# EAGLE board J007017_RGB_IR (EAGLE 7.7.0), part 1 of 4
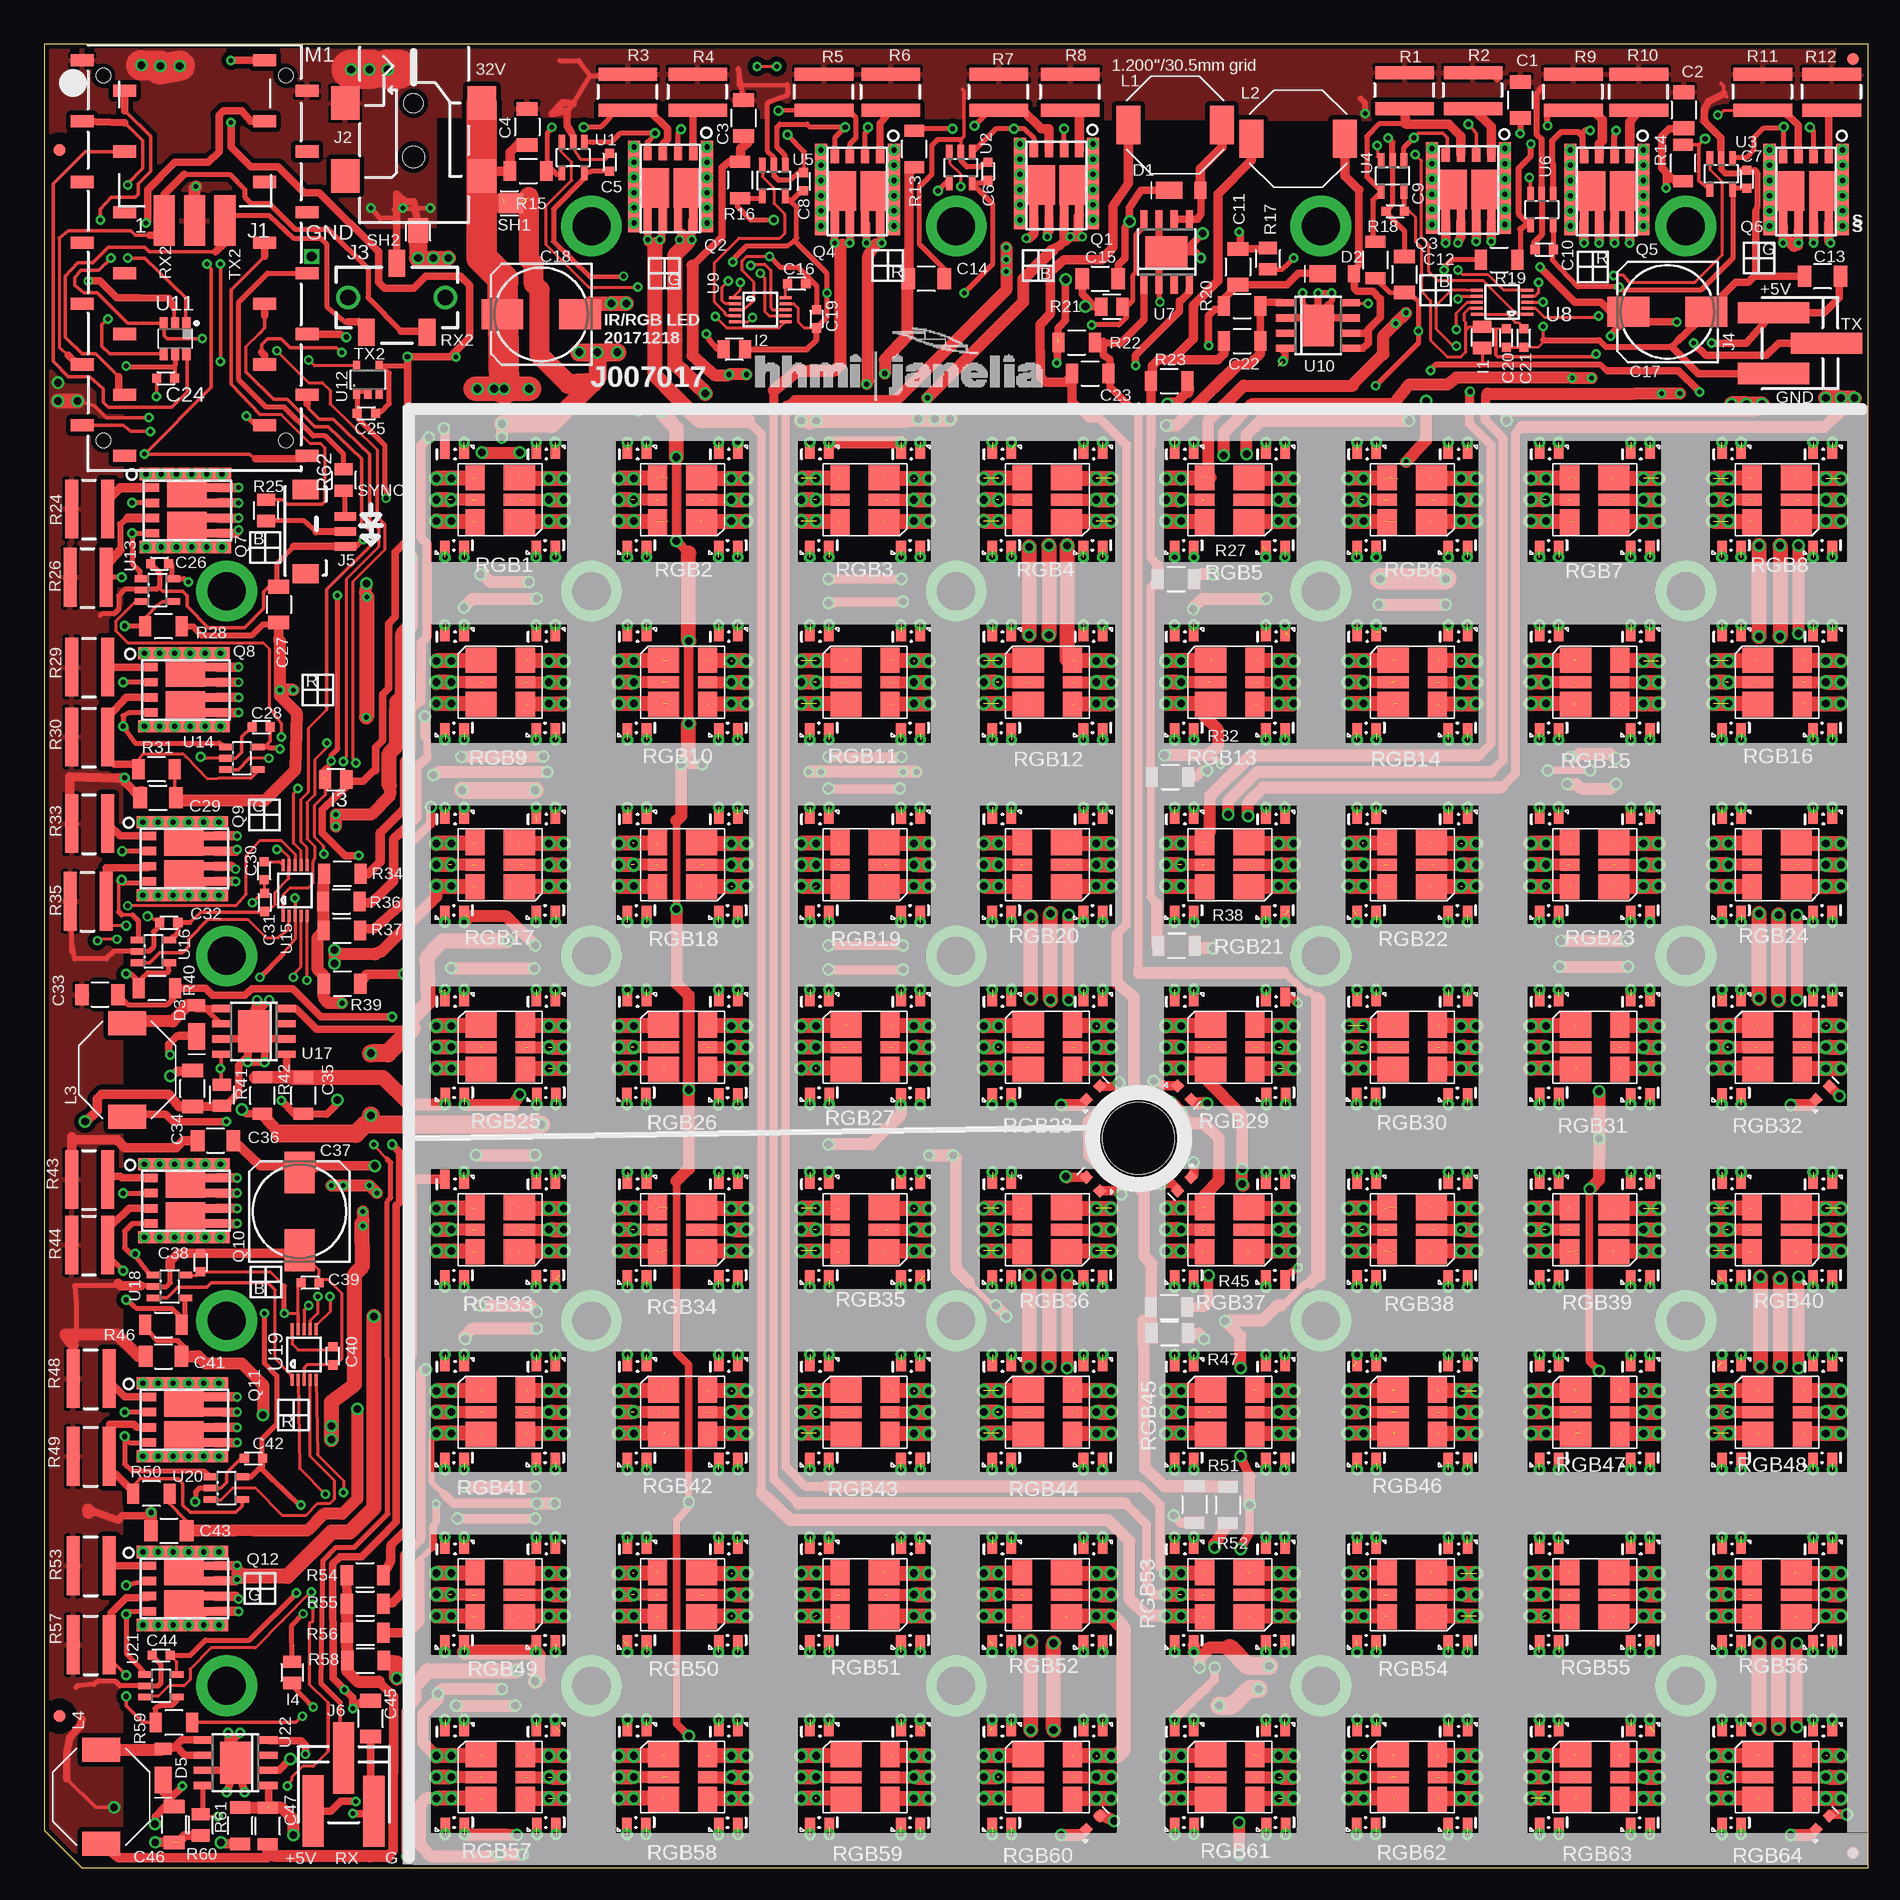
[diagram p4: board, top side]
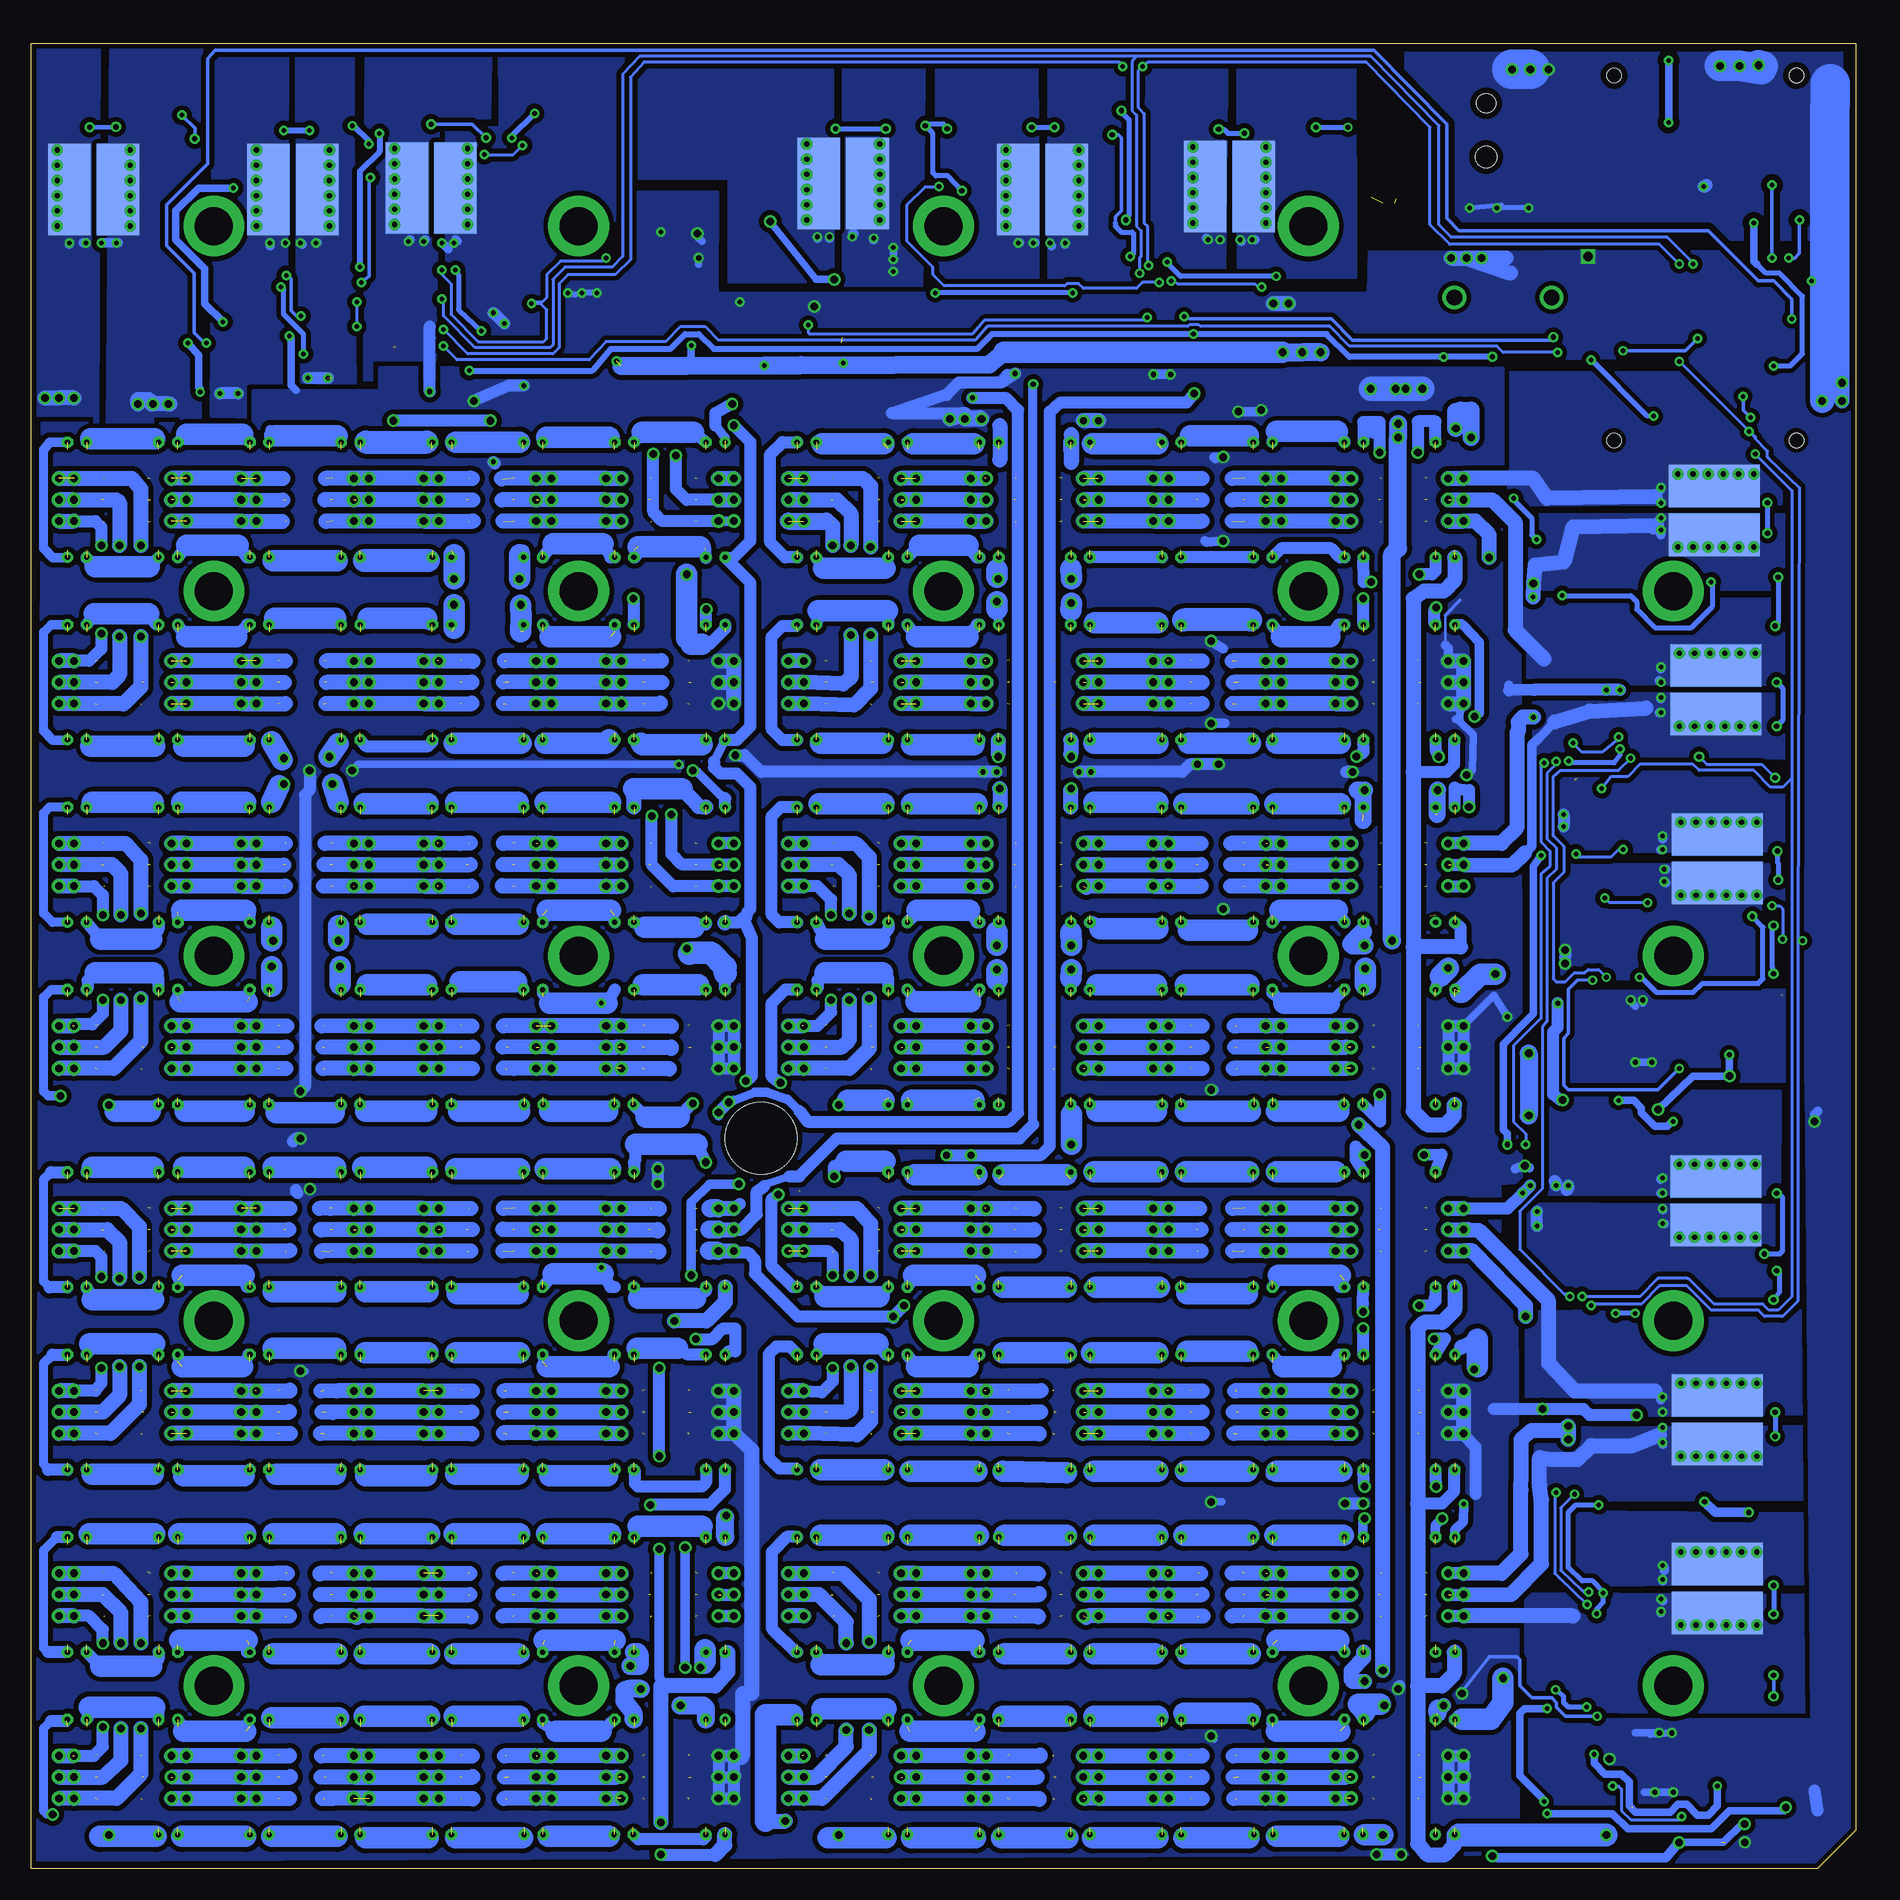
[diagram p5: board, bottom side, seen from below]

Size 152.4 x 152.4 mm. Coordinates in mm from the lower left corner, seen from the top.
Outline: 0,152.4 0,3.17 3.17,0 152.4,0 152.4,152.4 0,152.4
Copper layers (1*16): Top 0.068mm / dielectric 0.45mm / Bottom 0.068mm
Design rules "default *": minimum track width 8mil, minimum drill 12mil, track to track 8mil, track to pad 8mil, pad to pad 8mil, via to via 8mil, smd to smd 8mil, copper to edge 16mil, drill to drill 8mil, minimum pad ring 10mil, minimum via ring 8mil, stop-mask expansion 4mil, vias tented up to drill 25mil, thermal gap 10mil
Holes 5.99 mm at 91.44,60.96

## Footprints (pad centres in the part's own frame; a part is rotated, then mirrored left to right if it is on the bottom)
FIDUCIAL_1MM = smd 1 x 1: 1 0,0
1210S = smd 1.14 x 1.75: 1 -1.5,0; 2 1.5,0
0603S = smd 0.762 x 0.762: 1 -0.762,0; 2 0.762,0
153CLV-0810 = smd 3.5 x 2.5: + 3.25,0; - -3.25,0
1206S = smd 1.016 x 1.651: 1 -1.524,0; 2 1.524,0
PWRDI-123 = smd 1 x 1.4: A 1.6,0 | smd 2.2 x 1.4: K -1,0
LED_SFH4050_HEAT = smd 0.8 x 1.6: A -0.8,-0.4; C 0.8,-0.4 | drill 0.432 octagon: A1 -0.8,-1 | drill 0.432: C1 0.8,-1
0805S = smd 1.016 x 1.524: 1 -0.889,0; 2 0.889,0
LED_SFH4045_HEAT_A = smd 0.8 x 1.6: A -0.8,-0.4; C 0.8,-0.4 | drill 0.432 octagon: A1 -0.8,-1
LED_SFH4050_HEAT_C = smd 0.8 x 1.6: A -0.8,-0.4; C 0.8,-0.4 | drill 0.432: C1 0.8,-1
LED_SFH4050 = smd 0.8 x 0.8: A -0.8,0; C 0.8,0
AMP-3-SM-RA-X = smd 1.78 x 4.19: 1 -2.54,-14.78; 2 0,-14.78; 3 2.54,-14.78
PJ-002 = smd 2.8 x 2.4: 1A 5,5.7; 1B 11.1,5.7; 2 5,-5.7; 3 11.1,-5.7 | hole 1.6: 5,0 | hole 1.8: 9.5,0
AMP_3_SM = smd 1.397 x 2.261: 1 -2.54,2.883; 2 0,-2.883; 3 2.54,2.883 | drill 1.321: P$4 -4.064,0; P$5 4.064,0
TE_3_SM-V = smd 1.778 x 5.969: 1 2.54,-2.223; 2 0,2.223; 3 -2.54,-2.21
DF13_3_V_SM = smd 1.6 x 2.2: A -3.52,0.01; B 3.52,0.01 | smd 0.7 x 1.8: P$1 -1.27,3.31; P$2 -0.02,3.31; P$3 1.23,3.31
SRU8043 = smd 2.007 x 3.2: 1 -3.912,0; 2 3.912,0
TEENSY3.2_MIN_SM = smd 1.016 x 1.905: 1 -16.51,-9.398; 2 -13.97,-5.842; 3 -11.43,-9.398; 4 -8.89,-5.842; 5 -6.35,-9.398; 6 -3.81,-5.842; 7 -1.27,-9.398; 8 1.27,-5.842; 9 3.81,-9.398; 10 6.35,-5.842; 11 8.89,-9.398; 12 11.43,-5.842; 13 13.97,-9.398; 14 16.51,-5.842; 15 16.51,9.398; 16 13.97,5.842; 17 11.43,9.398; 18 8.89,5.842; 19 6.35,9.398; 20 3.81,5.842; 21 1.27,9.398; 22 -1.27,5.842; 23 -3.81,9.398; 24 -6.35,5.842; 25 -8.89,9.398; 26 -11.43,5.842; 27 -13.97,9.398; 28 -16.51,5.842 | hole 1.194: -15.24,7.62; 15.24,7.62; 15.24,-7.62; -15.24,-7.62
LFPAK56_HS2 = smd 0.7 x 1.15: 1 -1.905,-3.275; 2 -0.635,-3.275; 3 0.635,-3.275; 4 1.905,-3.275 | smd 0.7 x 1.9: 5 1.905,2.225; 6 0.635,2.225; 7 -0.635,2.225; 8 -1.905,2.225 | drill 0.432: 5A 3.048,1.27; 5A1 3.048,2.54; 5B 3.048,0; 5C 3.048,-1.27; 5C1 3.048,-2.54; 5C2 3.048,-3.81; 8A -3.048,1.27; 8B -3.048,0; 8C -3.048,-1.27; 8C1 -3.048,-2.54; 8C2 -3.048,2.54; 8C3 -3.048,-3.81 | smd 2.286 x 3.302: 56 1.27,-0.381; 78 -1.397,-0.381 | smd 1.016 x 7.62: 56A 3.048,-0.508; 78A -3.048,-0.508 | smd 3.556 x 7.62 bottom: 56B 2.032,-0.508; 78B -2.032,-0.508
1812 = smd 4.9 x 1.1: 1 0,1.5; 2 0,-1.5
OVSPRGB_HS_FIXED = smd 2.1 x 2.6: 1 1.85,1.6; 3 -1.85,1.6 | drill 0.635: 1A 1.778,4.064; 1B 1.778,5.334; 2A 0,4.064; 2B 0,5.334; 3A -1.778,4.064; 3B -1.778,5.334; 4A -1.778,-4.064; 4B -1.778,-5.334; 5A 0,-4.064; 5B 0,-5.334; 6A 1.778,-4.064; 6B 1.778,-5.334 | smd 1 x 2.6: 2 0,1.6 | smd 2.1 x 1.6: 4 -1.85,-2.1; 6 1.85,-2.1 | smd 1 x 1.6: 5 0,-2.1
JUMPER = smd 1.016 x 1.651: 1 -0.635,0; 2 0.381,0
SOT23-5 = smd 0.55 x 1.2: 1 -0.95,-1.3; 2 0,-1.3; 3 0.95,-1.3; 4 0.95,1.3; 5 -0.95,1.3
SOIC8-EP = smd 0.6 x 1.5: 1 -1.905,-2.75; 2 -0.635,-2.75; 3 0.635,-2.75; 4 1.905,-2.75; 5 1.905,2.75; 6 0.635,2.75; 7 -0.635,2.75; 8 -1.905,2.75 | smd 3.502 x 2.613: EP 0,0
MSOP10 = smd 0.25 x 1: 1 -1,-2.113; 2 -0.5,-2.113; 3 0,-2.113; 4 0.5,-2.113; 5 1,-2.113; 6 1,2.113; 7 0.5,2.113; 8 0,2.113; 9 -0.5,2.113; 10 -1,2.113
DBV_R-PDSO-G6 = smd 0.69 x 0.99: 1 -0.95,-1.29; 2 0,-1.29; 3 0.95,-1.29; 4 0.95,1.3; 5 0,1.3; 6 -0.95,1.3
SOT23-5' = smd 0.6 x 0.9: 1 -0.95,-1.15; 2 0,-1.15; 3 0.95,-1.15; 4 0.95,1.15; 5 -0.95,1.15

## Placement (x,y rotation side)
$$U$1  FIDUCIAL  [FIDUCIAL_1MM]  1.27,143.51 0 top
$$U$2  FIDUCIAL  [FIDUCIAL_1MM]  1.27,12.7 0 top
$$U$3  FIDUCIAL  [FIDUCIAL_1MM]  151.13,1.27 0 top
C1  6.8  [1210S]  123.32,147.7 90 top
C2  6.8  [1210S]  136.98,146.84 90 top
C3  6.8  [1210S]  58.42,146.18 90 top
C4  6.8  [1210S]  40.36,145.44 90 top
C5  0.1  [0603S]  47.24,142.49 90 top
C6  0.1  [0603S]  78.84,141.73 90 top
C7  0.1  [0603S]  142.24,141.07 90 top
C8  0.1  [0603S]  63.45,140.87 90 top
C9  0.1  [0603S]  112.88,138.4 180 top
C10  0.1  [0603S]  125.32,135.2 180 top
C11  10@50  [1210S]  99.75,133.76 90 top
C12  6.8  [1210S]  113.64,133.12 90 top
C13  6.8  [1210S]  148.56,132.97 0 top
C14  6.8  [1210S]  73.69,132.77 0 top
C15  10@50  [1210S]  88.24,132.77 180 top
C16  0.1  [0603S]  62.87,132.33 0 top
C17  [153CLV-0810]  135.61,130 180 top
C18  [153CLV-0810]  41.53,129.79 180 top
C19  0.1  [0603S]  64.52,129.41 90 top
C20  0.1  [0603S]  122.15,127.81 270 top
C21  0.1  [0603S]  123.62,127.81 270 top
C22  2.2@50  [1206S]  100.1,127.56 180 top
C23  2.2@50  [1206S]  87.4,124.84 180 top
C24  0.1  [0603S]  10.16,124.46 180 top
C25  0.1  [0603S]  26.92,121.54 180 top
C26  0.1  [0603S]  9.65,108.97 180 top
C27  6.8  [1210S]  19.61,105.54 90 top
C28  0.1  [0603S]  18.14,95.33 180 top
C29  6.8  [1210S]  9.53,89.41 180 top
C30  0.1  [0603S]  18.39,83.31 270 top
C31  0.1  [0603S]  18.41,80.67 90 top
C32  0.1  [0603S]  10.41,78.99 180 top
C33  6.8  [1210S]  4.67,72.97 180 top
C34  10@50  [1210S]  12.4,65.13 270 top
C35  2.2@50  [1206S]  21.67,64.54 270 top
C36  6.8  [1210S]  14.33,60.78 180 top
C37  [153CLV-0810]  21.34,54.86 90 top
C38  0.1  [0603S]  13.06,50.6 90 top
C39  0.1  [0603S]  22.23,48.9 0 top
C40  0.1  [0603S]  24.13,42.8 270 top
C41  6.8  [1210S]  9.98,42.75 180 top
C42  0.1  [0603S]  17.5,34.24 180 top
C43  6.8  [1210S]  10.41,28.19 180 top
C44  0.1  [0603S]  9.78,17.78 180 top
C45  6.8  [1210S]  27.28,12.5 270 top
C46  10@50  [1210S]  10.87,3.66 270 top
C47  2.2@50  [1206S]  18.67,3.53 270 top
D1  DLFS240L  [PWRDI-123]  95,140.16 0 top
D2  DLFS240L  [PWRDI-123]  107.82,133.17 0 top
D3  DLFS240L  [PWRDI-123]  12.75,70.48 90 top
D4  [LED_SFH4050_HEAT]  95.25,19.05 0 top
D5  DLFS240L  [PWRDI-123]  9.96,8.38 90 top
I1  [0805S]  120.14,127.86 90 top
I2  [0805S]  57.66,126.87 0 top
I3  [0805S]  24.36,90.93 180 top
I4  [0805S]  20.73,16.36 90 top
IR1  [LED_SFH4045_HEAT_A]  34.29,118.11 180 top
IR2  [LED_SFH4050_HEAT]  41.91,118.11 180 top
IR3  [LED_SFH4050_HEAT]  49.53,118.11 180 top
IR4  [LED_SFH4050_HEAT]  57.15,118.11 180 top
IR5  [LED_SFH4050_HEAT]  64.77,118.11 180 top
IR6  [LED_SFH4050_HEAT]  72.39,118.11 180 top
IR7  [LED_SFH4050_HEAT]  80.01,118.11 180 top
IR8  [LED_SFH4050_HEAT]  87.63,118.11 180 top
IR9  [LED_SFH4050_HEAT]  95.25,118.11 180 top
IR10  [LED_SFH4050_HEAT]  102.87,118.11 180 top
IR11  [LED_SFH4050_HEAT]  110.49,118.11 180 top
IR12  [LED_SFH4050_HEAT]  118.11,118.11 180 top
IR13  [LED_SFH4050_HEAT]  125.73,118.11 180 top
IR14  [LED_SFH4050_HEAT]  133.35,118.11 180 top
IR15  [LED_SFH4050_HEAT]  140.97,118.11 180 top
IR16  [LED_SFH4050_HEAT]  148.59,118.11 180 top
IR17  [LED_SFH4050_HEAT]  34.29,110.49 0 top
IR18  [LED_SFH4050_HEAT]  41.91,110.49 0 top
IR19  [LED_SFH4050_HEAT]  49.53,110.49 0 top
IR20  [LED_SFH4050_HEAT]  57.15,110.49 0 top
IR21  [LED_SFH4050_HEAT]  64.77,110.49 0 top
IR22  [LED_SFH4050_HEAT]  72.39,110.49 0 top
IR23  [LED_SFH4050_HEAT]  80.01,110.49 0 top
IR24  [LED_SFH4050_HEAT]  87.63,110.49 0 top
IR25  [LED_SFH4050_HEAT]  95.25,110.49 0 top
IR26  [LED_SFH4050_HEAT]  102.87,110.49 0 top
IR27  [LED_SFH4050_HEAT]  110.49,110.49 0 top
IR28  [LED_SFH4050_HEAT]  118.11,110.49 0 top
IR29  [LED_SFH4050_HEAT]  125.73,110.49 0 top
IR30  [LED_SFH4050_HEAT]  133.35,110.49 0 top
IR31  [LED_SFH4050_HEAT]  140.97,110.49 0 top
IR32  [LED_SFH4050_HEAT]  148.59,110.49 0 top
IR33  [LED_SFH4050_HEAT]  34.29,102.87 180 top
IR34  [LED_SFH4050_HEAT]  41.91,102.87 180 top
IR35  [LED_SFH4050_HEAT]  49.53,102.87 180 top
IR36  [LED_SFH4050_HEAT]  57.15,102.87 180 top
IR37  [LED_SFH4050_HEAT]  64.77,102.87 180 top
IR38  [LED_SFH4050_HEAT]  72.39,102.87 180 top
IR39  [LED_SFH4050_HEAT]  80.01,102.87 180 top
IR40  [LED_SFH4050_HEAT]  87.63,102.87 180 top
IR41  [LED_SFH4050_HEAT]  95.25,102.87 180 top
IR42  [LED_SFH4050_HEAT]  102.87,102.87 180 top
IR43  [LED_SFH4050_HEAT]  110.49,102.87 180 top
IR44  [LED_SFH4050_HEAT]  118.11,102.87 180 top
IR45  [LED_SFH4050_HEAT]  125.73,102.87 180 top
IR46  [LED_SFH4050_HEAT]  133.35,102.87 180 top
IR47  [LED_SFH4050_HEAT]  140.97,102.87 180 top
IR48  [LED_SFH4050_HEAT]  148.59,102.87 180 top
IR49  [LED_SFH4050_HEAT]  34.29,95.25 0 top
IR50  [LED_SFH4050_HEAT]  41.91,95.25 0 top
IR51  [LED_SFH4050_HEAT]  49.53,95.25 0 top
IR52  [LED_SFH4050_HEAT]  57.15,95.25 0 top
IR53  [LED_SFH4050_HEAT]  64.77,95.25 0 top
IR54  [LED_SFH4050_HEAT]  72.39,95.25 0 top
IR55  [LED_SFH4050_HEAT]  80.01,95.25 0 top
IR56  [LED_SFH4050_HEAT]  87.63,95.25 0 top
IR57  [LED_SFH4050_HEAT]  95.25,95.25 0 top
IR58  [LED_SFH4050_HEAT]  102.87,95.25 0 top
IR59  [LED_SFH4050_HEAT]  110.49,95.25 0 top
IR60  [LED_SFH4050_HEAT]  118.11,95.25 0 top
IR61  [LED_SFH4050_HEAT]  125.73,95.25 0 top
IR62  [LED_SFH4050_HEAT]  133.35,95.25 0 top
IR63  [LED_SFH4050_HEAT]  140.97,95.25 0 top
IR64  [LED_SFH4050_HEAT]  148.59,95.25 0 top
IR65  [LED_SFH4050_HEAT]  34.29,87.63 180 top
IR66  [LED_SFH4050_HEAT]  41.91,87.63 180 top
IR67  [LED_SFH4050_HEAT]  49.53,87.63 180 top
IR68  [LED_SFH4050_HEAT]  57.15,87.63 180 top
IR69  [LED_SFH4050_HEAT]  64.77,87.63 180 top
IR70  [LED_SFH4050_HEAT]  72.39,87.63 180 top
IR71  [LED_SFH4050_HEAT]  80.01,87.63 180 top
IR72  [LED_SFH4050_HEAT]  87.63,87.63 180 top
IR73  [LED_SFH4050_HEAT]  95.25,87.63 180 top
IR74  [LED_SFH4050_HEAT]  102.87,87.63 180 top
IR75  [LED_SFH4050_HEAT]  110.49,87.63 180 top
IR76  [LED_SFH4050_HEAT]  118.11,87.63 180 top
IR77  [LED_SFH4050_HEAT]  125.73,87.63 180 top
IR78  [LED_SFH4050_HEAT]  133.35,87.63 180 top
IR79  [LED_SFH4050_HEAT]  140.97,87.63 180 top
IR80  [LED_SFH4050_HEAT]  148.59,87.63 180 top
IR81  [LED_SFH4050_HEAT]  34.29,80.01 0 top
IR82  [LED_SFH4050_HEAT]  41.91,80.01 0 top
IR83  [LED_SFH4050_HEAT]  49.53,80.01 0 top
IR84  [LED_SFH4050_HEAT]  57.15,80.01 0 top
IR85  [LED_SFH4050_HEAT]  64.77,80.01 0 top
IR86  [LED_SFH4050_HEAT]  72.39,80.01 0 top
IR87  [LED_SFH4050_HEAT]  80.01,80.01 0 top
IR88  [LED_SFH4050_HEAT]  87.63,80.01 0 top
IR89  [LED_SFH4050_HEAT]  95.25,80.01 0 top
IR90  [LED_SFH4050_HEAT]  102.87,80.01 0 top
IR91  [LED_SFH4050_HEAT]  110.49,80.01 0 top
IR92  [LED_SFH4050_HEAT]  118.11,80.01 0 top
IR93  [LED_SFH4050_HEAT]  125.73,80.01 0 top
IR94  [LED_SFH4050_HEAT]  133.35,80.01 0 top
IR95  [LED_SFH4050_HEAT]  140.97,80.01 0 top
IR96  [LED_SFH4050_HEAT]  148.59,80.01 0 top
IR97  [LED_SFH4050_HEAT]  34.29,72.39 180 top
IR98  [LED_SFH4050_HEAT]  41.91,72.39 180 top
IR99  [LED_SFH4050_HEAT]  49.53,72.39 180 top
IR100  [LED_SFH4050_HEAT]  57.15,72.39 180 top
IR101  [LED_SFH4050_HEAT]  64.77,72.39 180 top
IR102  [LED_SFH4050_HEAT]  72.39,72.39 180 top
IR103  [LED_SFH4050_HEAT]  80.01,72.39 180 top
IR104  [LED_SFH4050_HEAT]  87.63,72.39 180 top
IR105  [LED_SFH4050_HEAT]  95.25,72.39 180 top
IR106  [LED_SFH4050_HEAT_C]  102.87,72.39 180 top
IR107  [LED_SFH4050_HEAT]  110.49,72.39 180 top
IR108  [LED_SFH4050_HEAT]  118.11,72.39 180 top
IR109  [LED_SFH4050_HEAT]  125.73,72.39 180 top
IR110  [LED_SFH4050_HEAT]  133.35,72.39 180 top
IR111  [LED_SFH4050_HEAT]  140.97,72.39 180 top
IR112  [LED_SFH4050_HEAT]  148.59,72.39 180 top
IR113  [LED_SFH4050_HEAT]  34.31,64.79 0 top
IR114  [LED_SFH4050_HEAT]  41.96,64.79 0 top
IR115  [LED_SFH4050_HEAT]  49.48,64.79 0 top
IR116  [LED_SFH4050_HEAT]  64.79,64.79 0 top
IR117  [LED_SFH4050]  95.27,64.79 315 top
IR118  [LED_SFH4050_HEAT]  102.92,64.79 0 top
IR119  [LED_SFH4050_HEAT]  110.44,64.79 0 top
IR120  [LED_SFH4050_HEAT]  125.75,64.79 0 top
IR121  [LED_SFH4050_HEAT]  57.15,64.77 0 top
IR122  [LED_SFH4050_HEAT]  72.39,64.77 0 top
IR123  [LED_SFH4050_HEAT]  80.01,64.77 0 top
IR124  [LED_SFH4050]  87.63,64.77 45 top
IR125  [LED_SFH4050_HEAT]  118.11,64.77 0 top
IR126  [LED_SFH4050_HEAT]  133.35,64.77 0 top
IR127  [LED_SFH4050_HEAT]  140.97,64.77 0 top
IR128  [LED_SFH4050]  148.59,64.77 45 top
IR129  [LED_SFH4045_HEAT_A]  34.29,57.15 180 top
IR130  [LED_SFH4050_HEAT]  41.91,57.15 180 top
IR131  [LED_SFH4050_HEAT]  49.53,57.15 180 top
IR132  [LED_SFH4050_HEAT]  57.15,57.15 180 top
IR133  [LED_SFH4050_HEAT]  64.77,57.15 180 top
IR134  [LED_SFH4050_HEAT]  72.39,57.15 180 top
IR135  [LED_SFH4050_HEAT]  80.01,57.15 180 top
IR136  [LED_SFH4050]  87.63,57.15 135 top
IR137  [LED_SFH4050]  95.25,57.15 225 top
IR138  [LED_SFH4050_HEAT]  102.87,57.15 180 top
IR139  [LED_SFH4050_HEAT]  110.49,57.15 180 top
IR140  [LED_SFH4050_HEAT]  118.11,57.15 180 top
IR141  [LED_SFH4050_HEAT]  125.73,57.15 180 top
IR142  [LED_SFH4050_HEAT]  133.35,57.15 180 top
IR143  [LED_SFH4050_HEAT]  140.97,57.15 180 top
IR144  [LED_SFH4050_HEAT]  148.59,57.15 180 top
IR145  [LED_SFH4050_HEAT]  34.29,49.53 0 top
IR146  [LED_SFH4050_HEAT]  41.91,49.53 0 top
IR147  [LED_SFH4050_HEAT]  49.53,49.53 0 top
IR148  [LED_SFH4050_HEAT]  57.15,49.53 0 top
IR149  [LED_SFH4050_HEAT]  64.77,49.53 0 top
IR150  [LED_SFH4050_HEAT]  72.39,49.53 0 top
IR151  [LED_SFH4050_HEAT]  80.01,49.53 0 top
IR152  [LED_SFH4050_HEAT]  87.63,49.53 0 top
IR153  [LED_SFH4050_HEAT]  95.25,49.53 0 top
IR154  [LED_SFH4045_HEAT_A]  102.87,49.53 0 top
IR155  [LED_SFH4050_HEAT]  110.49,49.53 0 top
IR156  [LED_SFH4050_HEAT]  118.11,49.53 0 top
IR157  [LED_SFH4050_HEAT]  125.73,49.53 0 top
IR158  [LED_SFH4050_HEAT]  133.35,49.53 0 top
IR159  [LED_SFH4050_HEAT]  140.97,49.53 0 top
IR160  [LED_SFH4050_HEAT]  148.59,49.53 0 top
IR161  [LED_SFH4050_HEAT]  34.29,41.91 180 top
IR162  [LED_SFH4050_HEAT]  41.91,41.91 180 top
IR163  [LED_SFH4050_HEAT]  49.53,41.91 180 top
IR164  [LED_SFH4050_HEAT]  57.15,41.91 180 top
IR165  [LED_SFH4050_HEAT]  64.77,41.91 180 top
IR166  [LED_SFH4050_HEAT]  72.39,41.91 180 top
IR167  [LED_SFH4050_HEAT]  80.01,41.91 180 top
IR168  [LED_SFH4050_HEAT]  87.63,41.91 180 top
IR169  [LED_SFH4050_HEAT]  95.25,41.91 180 top
IR170  [LED_SFH4050_HEAT]  102.87,41.91 180 top
IR171  [LED_SFH4050_HEAT]  110.49,41.91 180 top
IR172  [LED_SFH4050_HEAT]  118.11,41.91 180 top
IR173  [LED_SFH4050_HEAT]  125.73,41.91 180 top
IR174  [LED_SFH4050_HEAT]  133.35,41.91 180 top
IR175  [LED_SFH4050_HEAT]  140.97,41.91 180 top
IR176  [LED_SFH4050_HEAT]  148.59,41.91 180 top
IR177  [LED_SFH4050_HEAT]  34.29,34.29 0 top
IR178  [LED_SFH4050_HEAT]  41.91,34.29 0 top
IR179  [LED_SFH4050_HEAT]  49.53,34.29 0 top
IR180  [LED_SFH4050_HEAT]  57.15,34.29 0 top
IR181  [LED_SFH4050_HEAT]  64.77,34.29 0 top
IR182  [LED_SFH4050_HEAT]  72.39,34.29 0 top
IR183  [LED_SFH4050_HEAT]  80.01,34.29 0 top
IR184  [LED_SFH4050_HEAT]  87.63,34.29 0 top
IR185  [LED_SFH4050_HEAT]  95.25,34.29 0 top
IR186  [LED_SFH4050_HEAT]  102.87,34.29 0 top
IR187  [LED_SFH4050_HEAT]  110.49,34.29 0 top
IR188  [LED_SFH4050_HEAT]  118.11,34.29 0 top
IR189  [LED_SFH4050_HEAT]  125.73,34.29 0 top
IR190  [LED_SFH4050_HEAT]  133.35,34.29 0 top
IR191  [LED_SFH4050_HEAT]  140.97,34.29 0 top
IR192  [LED_SFH4050_HEAT]  148.59,34.29 0 top
IR193  [LED_SFH4050_HEAT]  34.29,26.67 180 top
IR194  [LED_SFH4050_HEAT]  41.91,26.67 180 top
IR195  [LED_SFH4050_HEAT]  49.53,26.67 180 top
IR196  [LED_SFH4050_HEAT]  57.15,26.67 180 top
IR197  [LED_SFH4050_HEAT]  64.77,26.67 180 top
IR198  [LED_SFH4050_HEAT]  72.39,26.67 180 top
IR199  [LED_SFH4050_HEAT]  80.01,26.67 180 top
IR200  [LED_SFH4050_HEAT]  87.63,26.67 180 top
IR201  [LED_SFH4050_HEAT]  95.25,26.67 180 top
IR202  [LED_SFH4050_HEAT]  102.87,26.67 180 top
IR203  [LED_SFH4050_HEAT]  110.49,26.67 180 top
IR204  [LED_SFH4050_HEAT]  118.11,26.67 180 top
IR205  [LED_SFH4050_HEAT]  125.73,26.67 180 top
IR206  [LED_SFH4050_HEAT]  133.35,26.67 180 top
IR207  [LED_SFH4050_HEAT]  140.97,26.67 180 top
IR208  [LED_SFH4050_HEAT]  148.59,26.67 180 top
IR209  [LED_SFH4050_HEAT]  34.29,19.05 0 top
IR210  [LED_SFH4050_HEAT]  41.91,19.05 0 top
IR211  [LED_SFH4050_HEAT]  49.53,19.05 0 top
IR212  [LED_SFH4050_HEAT]  57.15,19.05 0 top
IR213  [LED_SFH4050_HEAT]  64.77,19.05 0 top
IR214  [LED_SFH4050_HEAT]  72.39,19.05 0 top
IR215  [LED_SFH4050_HEAT]  80.01,19.05 0 top
IR216  [LED_SFH4050_HEAT]  87.63,19.05 0 top
IR217  [LED_SFH4050_HEAT]  102.87,19.05 0 top
IR218  [LED_SFH4050_HEAT]  110.49,19.05 0 top
IR219  [LED_SFH4050_HEAT]  118.11,19.05 0 top
IR220  [LED_SFH4050_HEAT]  125.73,19.05 0 top
IR221  [LED_SFH4050_HEAT]  133.35,19.05 0 top
IR222  [LED_SFH4050_HEAT]  140.97,19.05 0 top
IR223  [LED_SFH4050_HEAT]  148.59,19.05 0 top
IR224  [LED_SFH4050_HEAT]  34.29,11.43 180 top
IR225  [LED_SFH4050_HEAT]  41.91,11.43 180 top
IR226  [LED_SFH4050_HEAT]  49.53,11.43 180 top
IR227  [LED_SFH4050_HEAT]  57.15,11.43 180 top
IR228  [LED_SFH4050_HEAT]  64.77,11.43 180 top
IR229  [LED_SFH4050_HEAT]  72.39,11.43 180 top
IR230  [LED_SFH4050_HEAT]  80.01,11.43 180 top
IR231  [LED_SFH4050_HEAT]  87.63,11.43 180 top
IR232  [LED_SFH4050_HEAT]  95.25,11.43 180 top
IR233  [LED_SFH4050_HEAT]  102.87,11.43 180 top
IR234  [LED_SFH4050_HEAT]  110.49,11.43 180 top
IR235  [LED_SFH4050_HEAT]  118.11,11.43 180 top
IR236  [LED_SFH4050_HEAT]  125.73,11.43 180 top
IR237  [LED_SFH4050_HEAT]  133.35,11.43 180 top
IR238  [LED_SFH4050_HEAT]  140.97,11.43 180 top
IR239  [LED_SFH4050_HEAT]  148.59,11.43 180 top
IR240  [LED_SFH4050_HEAT]  34.31,3.83 0 top
IR241  [LED_SFH4050_HEAT]  41.96,3.83 0 top
IR242  [LED_SFH4050_HEAT]  49.48,3.83 0 top
IR243  [LED_SFH4050_HEAT]  64.79,3.83 0 top
IR244  [LED_SFH4050_HEAT]  95.27,3.83 0 top
IR245  [LED_SFH4050_HEAT]  102.92,3.83 0 top
IR246  [LED_SFH4050_HEAT]  110.44,3.83 0 top
IR247  [LED_SFH4050_HEAT]  125.75,3.83 0 top
IR248  [LED_SFH4050_HEAT]  57.15,3.81 0 top
IR249  [LED_SFH4050_HEAT]  72.39,3.81 0 top
IR250  [LED_SFH4050_HEAT]  80.01,3.81 0 top
IR251  [LED_SFH4050]  87.63,3.81 45 top
IR252  [LED_SFH4050_HEAT]  118.11,3.81 0 top
IR253  [LED_SFH4050_HEAT]  133.35,3.81 0 top
IR254  [LED_SFH4050_HEAT]  140.97,3.81 0 top
IR255  [LED_SFH4050]  148.59,3.81 45 top
J1  [AMP-3-SM-RA-X]  12.57,152.4 0 top
J2  [PJ-002]  30.86,152.43 270 top
J3  [AMP_3_SM]  29.46,131.19 180 top
J4  [TE_3_SM-V]  146.69,127.38 270 top
J5  [DF13_3_V_SM]  21.84,111.63 270 top
J6  [TE_3_SM-V]  25.02,6.99 0 top
L1  68uH/1A  [SRU8043]  94.49,145.59 0 top
L2  68uH/1A  [SRU8043]  104.78,144.45 0 top
L3  68uH/1A  [SRU8043]  6.93,66.67 90 top
L4  68uH/1A  [SRU8043]  4.78,5.97 90 top
M1  TEESNY3.2_MIN  [TEENSY3.2_MIN_SM]  12.57,134.49 270 top
Q1  NPN_DUALLFPAK56_BIGHS  [LFPAK56_HS2]  84.58,140.21 180 top
Q2  NPN_DUALLFPAK56_BIGHS  [LFPAK56_HS2]  52.32,139.95 180 top
Q3  NPN_DUALLFPAK56_BIGHS  [LFPAK56_HS2]  119,139.83 180 top
Q4  NPN_DUALLFPAK56_BIGHS  [LFPAK56_HS2]  67.94,139.7 180 top
Q5  NPN_DUALLFPAK56_BIGHS  [LFPAK56_HS2]  130.56,139.7 180 top
Q6  NPN_DUALLFPAK56_BIGHS  [LFPAK56_HS2]  147.19,139.7 180 top
Q7  NPN_DUALLFPAK56_BIGHS  [LFPAK56_HS2]  12.32,113.41 270 top
Q8  NPN_DUALLFPAK56_BIGHS  [LFPAK56_HS2]  12.19,98.42 270 top
Q9  NPN_DUALLFPAK56_BIGHS  [LFPAK56_HS2]  12.06,84.33 270 top
Q10  NPN_DUALLFPAK56_BIGHS  [LFPAK56_HS2]  12.19,55.75 270 top
Q11  NPN_DUALLFPAK56_BIGHS  [LFPAK56_HS2]  12.06,37.47 270 top
Q12  NPN_DUALLFPAK56_BIGHS  [LFPAK56_HS2]  12.06,23.37 270 top
R1  4R0  [1812]  113.67,148.46 0 top
R2  4R0  [1812]  119.38,148.46 0 top
R3  4R0  [1812]  48.77,148.34 0 top
R4  4R0  [1812]  54.61,148.34 0 top
R5  4R0  [1812]  65.15,148.34 0 top
R6  4R0  [1812]  70.74,148.34 0 top
R7  4R0  [1812]  79.76,148.34 0 top
R8  4R0  [1812]  85.72,148.34 0 top
R9  4R0  [1812]  127.76,148.34 0 top
R10  4R0  [1812]  133.22,148.34 0 top
R11  4R0  [1812]  143.59,148.34 0 top
R12  4R0  [1812]  149.35,148.34 0 top
R13  10K0  [1206S]  72.69,143.61 270 top
R14  10K0  [1206S]  136.93,142.42 270 top
R15  10K0  [1206S]  40.44,141.76 180 top
R16  10K0  [1206S]  58.14,141.02 90 top
R17  4.99K  [0805S]  102.23,134.44 270 top
R18  10K0  [1206S]  111.23,134.34 270 top
R19  10K0  [1206S]  121.56,134.34 180 top
R20  1R00  [1206S]  100.1,130.48 180 top
R21  4.99K  [0805S]  89.2,130.43 0 top
R22  1R00  [1206S]  86.26,127.43 180 top
R23  10R0  [1206S]  94,124.22 180 top
R24  4R0  [1812]  3.81,113.54 90 top
R25  332  [0805S]  18.54,113.41 90 top
R26  4R0  [1812]  3.68,107.82 90 top
R27  10R0  [1206S]  94.56,107.67 180 top
R28  10K0  [1206S]  9.96,103.73 0 top
R29  4R0  [1812]  3.81,100.33 90 top
R30  4R0  [1812]  3.81,94.49 90 top
R31  10K0  [1206S]  9.4,91.8 0 top
R32  10R0  [1206S]  94.08,91.14 180 top
R33  4R0  [1812]  3.81,87.25 90 top
R34  10R0  [1206S]  24.91,83.07 180 top
R35  4R0  [1812]  3.68,80.77 90 top
R36  10R0  [1206S]  24.84,80.75 180 top
R37  10R0  [1206S]  24.87,78.32 180 top
R38  10R0  [1206S]  94.62,77.06 180 top
R39  10R0  [1206S]  24.9,73.89 180 top
R40  10K0  [1206S]  9.42,73.51 0 top
R41  4.99K  [0805S]  14.86,64.57 90 top
R42  1R00  [1206S]  18.24,64.54 270 top
R43  4R0  [1812]  3.81,57.53 90 top
R44  4R0  [1812]  3.81,52.07 90 top
R45  10R0  [1206S]  94,46.88 180 top
R46  10K0  [1206S]  9.98,45.39 180 top
R47  10R0  [1206S]  94.05,44.68 180 top
R48  4R0  [1812]  3.94,40.89 90 top
R49  4R0  [1812]  3.94,34.42 90 top
R50  10K0  [1206S]  8.97,31.29 0 top
R51  10R0  [1206S]  96.1,30.38 90 top
R52  10R0  [1206S]  98.9,30.34 90 top
R53  4R0  [1812]  3.94,25.27 90 top
R54  10R0  [1206S]  26.82,24.48 180 top
R55  10R0  [1206S]  26.82,22.1 180 top
R56  10R0  [1206S]  26.83,19.67 180 top
R57  4R0  [1812]  3.94,18.67 90 top
R58  10R0  [1206S]  26.86,17.35 180 top
R59  10K0  [1206S]  10.85,12.17 0 top
R60  4.99K  [0805S]  13.08,3.63 90 top
R61  1R00  [1206S]  16.38,3.56 270 top
R62  100  [0805S]  25.02,115.95 90 top
RGB1  LED_RGBRGB_LED  [OVSPRGB_HS_FIXED]  38.1,114.3 270 top
RGB2  LED_RGBRGB_LED  [OVSPRGB_HS_FIXED]  53.34,114.3 270 top
RGB3  LED_RGBRGB_LED  [OVSPRGB_HS_FIXED]  68.58,114.3 270 top
RGB4  LED_RGBRGB_LED  [OVSPRGB_HS_FIXED]  83.82,114.3 270 top
RGB5  LED_RGBRGB_LED  [OVSPRGB_HS_FIXED]  99.06,114.3 270 top
RGB6  LED_RGBRGB_LED  [OVSPRGB_HS_FIXED]  114.3,114.3 270 top
RGB7  LED_RGBRGB_LED  [OVSPRGB_HS_FIXED]  129.54,114.3 270 top
RGB8  LED_RGBRGB_LED  [OVSPRGB_HS_FIXED]  144.78,114.3 270 top
RGB9  RGB_LED  [OVSPRGB_HS_FIXED]  38.1,99.06 90 top
RGB10  RGB_LED  [OVSPRGB_HS_FIXED]  53.34,99.06 90 top
RGB11  LED_RGBRGB_LED  [OVSPRGB_HS_FIXED]  68.58,99.06 90 top
RGB12  LED_RGBRGB_LED  [OVSPRGB_HS_FIXED]  83.82,99.06 90 top
RGB13  LED_RGBRGB_LED  [OVSPRGB_HS_FIXED]  99.06,99.06 90 top
RGB14  LED_RGBRGB_LED  [OVSPRGB_HS_FIXED]  114.3,99.06 90 top
RGB15  LED_RGBRGB_LED  [OVSPRGB_HS_FIXED]  129.54,99.06 90 top
RGB16  LED_RGBRGB_LED  [OVSPRGB_HS_FIXED]  144.78,99.06 90 top
RGB17  LED_RGBRGB_LED  [OVSPRGB_HS_FIXED]  38.1,83.82 270 top
RGB18  LED_RGBRGB_LED  [OVSPRGB_HS_FIXED]  53.34,83.82 270 top
RGB19  LED_RGBRGB_LED  [OVSPRGB_HS_FIXED]  68.58,83.82 270 top
RGB20  LED_RGBRGB_LED  [OVSPRGB_HS_FIXED]  83.82,83.82 270 top
RGB21  LED_RGBRGB_LED  [OVSPRGB_HS_FIXED]  99.06,83.82 270 top
RGB22  LED_RGBRGB_LED  [OVSPRGB_HS_FIXED]  114.3,83.82 270 top
RGB23  LED_RGBRGB_LED  [OVSPRGB_HS_FIXED]  129.54,83.82 270 top
RGB24  LED_RGBRGB_LED  [OVSPRGB_HS_FIXED]  144.78,83.82 270 top
RGB25  LED_RGBRGB_LED  [OVSPRGB_HS_FIXED]  38.1,68.58 90 top
RGB26  LED_RGBRGB_LED  [OVSPRGB_HS_FIXED]  53.34,68.58 90 top
RGB27  LED_RGBRGB_LED  [OVSPRGB_HS_FIXED]  68.58,68.58 90 top
RGB28  LED_RGBRGB_LED  [OVSPRGB_HS_FIXED]  83.82,68.58 90 top
RGB29  LED_RGBRGB_LED  [OVSPRGB_HS_FIXED]  99.06,68.58 90 top
RGB30  LED_RGBRGB_LED  [OVSPRGB_HS_FIXED]  114.3,68.58 90 top
RGB31  LED_RGBRGB_LED  [OVSPRGB_HS_FIXED]  129.54,68.58 90 top
RGB32  LED_RGBRGB_LED  [OVSPRGB_HS_FIXED]  144.78,68.58 90 top
RGB33  LED_RGBRGB_LED  [OVSPRGB_HS_FIXED]  38.1,53.34 270 top
RGB34  LED_RGBRGB_LED  [OVSPRGB_HS_FIXED]  53.34,53.34 270 top
RGB35  LED_RGBRGB_LED  [OVSPRGB_HS_FIXED]  68.58,53.34 270 top
RGB36  LED_RGBRGB_LED  [OVSPRGB_HS_FIXED]  83.82,53.34 270 top
RGB37  LED_RGBRGB_LED  [OVSPRGB_HS_FIXED]  99.06,53.34 270 top
RGB38  LED_RGBRGB_LED  [OVSPRGB_HS_FIXED]  114.3,53.34 270 top
RGB39  LED_RGBRGB_LED  [OVSPRGB_HS_FIXED]  129.54,53.34 270 top
RGB40  LED_RGBRGB_LED  [OVSPRGB_HS_FIXED]  144.78,53.34 270 top
RGB41  LED_RGBRGB_LED  [OVSPRGB_HS_FIXED]  38.1,38.1 90 top
RGB42  LED_RGBRGB_LED  [OVSPRGB_HS_FIXED]  53.34,38.1 90 top
RGB43  LED_RGBRGB_LED  [OVSPRGB_HS_FIXED]  68.58,38.1 90 top
RGB44  LED_RGBRGB_LED  [OVSPRGB_HS_FIXED]  83.82,38.1 90 top
RGB45  LED_RGBRGB_LED  [OVSPRGB_HS_FIXED]  99.06,38.1 90 top
RGB46  LED_RGBRGB_LED  [OVSPRGB_HS_FIXED]  114.3,38.1 90 top
RGB47  LED_RGBRGB_LED  [OVSPRGB_HS_FIXED]  129.54,38.1 90 top
RGB48  LED_RGBRGB_LED  [OVSPRGB_HS_FIXED]  144.78,38.1 90 top
RGB49  LED_RGBRGB_LED  [OVSPRGB_HS_FIXED]  38.1,22.86 270 top
RGB50  LED_RGBRGB_LED  [OVSPRGB_HS_FIXED]  53.34,22.86 270 top
RGB51  LED_RGBRGB_LED  [OVSPRGB_HS_FIXED]  68.58,22.86 270 top
RGB52  LED_RGBRGB_LED  [OVSPRGB_HS_FIXED]  83.82,22.86 270 top
RGB53  LED_RGBRGB_LED  [OVSPRGB_HS_FIXED]  99.06,22.86 270 top
RGB54  LED_RGBRGB_LED  [OVSPRGB_HS_FIXED]  114.3,22.86 270 top
RGB55  LED_RGBRGB_LED  [OVSPRGB_HS_FIXED]  129.54,22.86 270 top
RGB56  LED_RGBRGB_LED  [OVSPRGB_HS_FIXED]  144.78,22.86 270 top
RGB57  LED_RGBRGB_LED  [OVSPRGB_HS_FIXED]  38.1,7.62 90 top
RGB58  LED_RGBRGB_LED  [OVSPRGB_HS_FIXED]  53.34,7.62 90 top
RGB59  LED_RGBRGB_LED  [OVSPRGB_HS_FIXED]  68.58,7.62 90 top
RGB60  LED_RGBRGB_LED  [OVSPRGB_HS_FIXED]  83.82,7.62 90 top
RGB61  LED_RGBRGB_LED  [OVSPRGB_HS_FIXED]  99.06,7.62 90 top
RGB62  LED_RGBRGB_LED  [OVSPRGB_HS_FIXED]  114.3,7.62 90 top
RGB63  LED_RGBRGB_LED  [OVSPRGB_HS_FIXED]  129.54,7.62 90 top
RGB64  LED_RGBRGB_LED  [OVSPRGB_HS_FIXED]  144.78,7.62 90 top
SH1  JUMPER  [JUMPER]  38.86,139.06 180 top
SH2  JUMPER  [JUMPER]  31.24,136.65 270 top
U1  AD8613  [SOT23-5]  44.2,142.88 180 top
U2  AD8613  [SOT23-5]  76.58,142.04 180 top
U3  AD8613  [SOT23-5]  140.11,141.53 180 top
U4  AD8613  [SOT23-5]  112.65,141.35 180 top
U5  AD8613  [SOT23-5]  60.96,140.97 180 top
U6  AD8613  [SOT23-5]  125.12,138.53 180 top
U7  AP8802  [SOIC8-EP]  93.78,135 0 top
U8  AD5624  [MSOP10]  121.79,130.81 90 top
U9  AD5624  [MSOP10]  59.82,130.18 270 top
U10  AP8802  [SOIC8-EP]  106.43,128.85 270 top
U11  741G3157DBVR  [DBV_R-PDSO-G6]  10.95,127.76 180 top
U12  LM26  [SOT23-5']  27.05,124.33 0 top
U13  AD8613  [SOT23-5]  9.47,106.76 270 top
U14  AD8613  [SOT23-5]  16.51,92.71 270 top
U15  AD5624R  [MSOP10]  20.95,81.66 0 top
U16  AD8613  [SOT23-5]  9.14,76.58 270 top
U17  AP8802  [SOIC8-EP]  17.53,69.9 90 top
U18  AD8613  [SOT23-5]  10.49,48.59 270 top
U19  AD5624  [MSOP10]  21.72,42.93 0 top
U20  AD8613  [SOT23-5]  15.24,31.75 270 top
U21  AD8613  [SOT23-5]  9.78,15.24 270 top
U22  AP8802  [SOIC8-EP]  16,8.81 90 top
U$2  FIDUCIAL  [FIDUCIAL_1MM]  151.13,151.13 0 top

## Tracks (layer width: path | path; a pad name or v marks a point on that pad's centre or on a via)
3V3  (via drill 0.38)
  Top 0.305: U11.5 10.95,124.87 C24.1
  Top 0.406: U11.5 10.95,125.5 10.79,125.35 6.99,125.35 v6.86,125.48
  Top 0.61: M1.26 17.27,145.92 16.51,146.81 14.99,146.81 14.61,146.43 14.61,143.38 13.72,142.49 10.92,142.49 8.64,140.21 8.64,137.54 v8.51,137.41
  Bottom 0.406: v6.86,125.48 5.46,125.48 4.45,126.49 4.45,131.32 6.35,133.22 7.49,133.22 8.26,133.99
  Bottom 0.61: v8.51,137.41 8.51,134.24 8.26,133.99
+5LL  (via drill 0.38)
  Top 0.254: U21.5 11.08,17.24 C44.1 | C39.1 21.22,48.65 U19.9 21.21,46.17 21.16,46.35 v20.07,46.35 | U18.5 12.76,49.54 C38.1 18.87,49.84 20.07,48.64
  Top 0.406: C44.1 12.19,17.78 13.46,19.05 17.14,19.05 v21.08,22.99 | v21.46,30.35 21.26,30.35 19.18,32.38 18.26,33.3 18.26,33.66 | 18.26,33.66 C42.1 | U20.5 17.31,32.7 18.26,33.66 | C42.1 18.36,34.24 | v18.41,46.35 18.41,42.16 19.43,41.15 19.43,37.08 18.16,35.81 18.16,34.34 C42.1 | v20.07,46.35 20.07,48.64 | I4.2 20.7,20.27 v21.64,21.26
  Bottom 0.406: v21.46,30.35 23.37,30.35 24,29.72 24,25.12 22.86,24 21.97,24 21.11,23.14 21.11,23.06 v21.08,22.99 21.08,22.2 21.64,21.64 v21.64,21.26 | v18.41,46.35 v20.07,46.35
+5LR  (via drill 0.38)
  Top 0.254: 47.21,141.7 C5.1 | U9.9 62.62,130.68 62.99,130.3 62.99,129.16 63.5,128.65 C19.1
  Top 0.406: C5.1 45.72,141.73 45.21,141.48 | v48.41,132.97 45.59,132.92 42.55,135.89 42.55,138.56 45.21,141.22 45.21,141.48 | v57.53,134.16 57.53,134.37 58.67,135.51 62.1,135.51 62.67,135.95 | 62.67,135.95 62.87,136.14 62.87,138.72 62.37,139.21 | 62.37,139.21 U5.5 | C8.1 63.27,140.11 62.37,139.21 | C19.1 65.41,129.54 v65.41,131.57 65.41,133.22 62.67,135.95 | 45.21,141.48 45.21,141.51 U1.5 | C6.1 78.74,140.97 78.51,140.74 U2.5 79.25,139.02 79.25,133.99 76.94,131.65 v76.89,131.57
  Top 0.508: I2.2 63.75,126.87 64.52,127.64 C19.1
  Bottom 0.406: v48.41,132.97 56.39,132.97 57.53,134.11 v57.53,134.16 | v65.41,131.57 v76.89,131.57
+5UL  (via drill 0.38)  (1 unrouted)
  Top 0.254: I3.2 23.47,89.66 | 23.47,89.66 23.47,89.61 | C31.1 18.69,79.91 19.3,80.52 19.3,81.53 20.45,82.68 U15.9 20.45,84.45 19.81,85.09 v19.43,85.09 | v23.37,84.71 23.37,85.34 22.61,86.11 22.61,88.8 23.47,89.66
  Top 0.305: 12.19,78.99 13.08,79.83 18.34,79.83 C31.1 | C28.1 18.9,94.14 18.41,93.66
  Top 0.406: U14.5 18.41,93.66 18.73,93.66 18.8,93.6 19.43,93.6 v19.68,93.47 | 23.24,91.06 23.24,91.57 23.98,92.3 v23.98,92.48 23.98,92.94 24.08,93.04 24.54,93.52 v24.51,106.3 | U16.5 10.67,77.75 10.83,77.75 11.18,78.11 C32.1 12.19,78.99 | C26.1 10.54,108.97 10.67,108.84 10.67,107.81 U13.5 11.67,107.71 12.06,107.31 v12.06,107.44 | 19.05,95.48 C28.1
  Bottom 0.254: v19.43,85.09 19.81,85.09 20.45,84.45 23.11,84.45 v23.37,84.71
  Bottom 0.406: v19.68,93.47 19.68,92.96 20.19,92.33 23.77,92.33 v23.98,92.48 | v24.51,106.3 18.8,106.3 18.29,105.79 18.29,105.16 16.76,103.63 13.72,103.63 11.94,105.41 11.94,107.06 v12.06,107.44
+5UR  (via drill 0.38)
  Top 0.254: C9.1 114.07,138.41 114.55,137.92 114.55,135.89 115.06,135.38 115.06,131.7 115.82,130.94 115.82,127.64 117.22,126.24 118.36,126.24 118.75,126.62 118.75,128.37 | U8.9 119.08,130.31 118.62,129.84 118.62,129.29 118.75,129.16 118.75,128.37 | 118.75,128.37 119.02,128.73 I1.2 120.17,128.52 121.27,128.56 C20.1
  Top 0.305: 121.27,128.56 121.27,126.43 121.44,126.26 129.44,126.26 v129.67,126.49
  Top 0.406: U4.5 113.6,138.44 C9.1 | C7.1 141.14,140.31 U3.5 141.06,140 141.1,139.7 141.1,134.49 138.43,131.83 131.7,131.83 v131.57,132.08 128.14,132.08 125.98,134.37 125.98,134.75 126.29,135.2 C10.1 126.07,135.22 U6.5
  Bottom 0.406: v129.67,126.49 129.67,128.14 131.32,129.79 131.32,131.83 v131.57,132.08
+5VD  (via drill 0.38, 0.43)  (1 unrouted)
  Top 0.254: I1.1 120.14,125.65 120.09,125.6
  Top 0.406: 24.13,15.93 24.13,15.88 v25.07,14.91 | v22.48,13.46 20.9,15.11 I4.1 | 30.35,123.44 30.35,125.48 U12.4 28.83,124.91 28.83,122.3 28.19,121.67 C25.1
  Top 0.508: v55.32,128.14 55.58,127.64 56.26,126.87 I2.1 | v115.82,125.09 116.33,125.6 120.09,125.6 129.97,125.6 130.61,125.09
  Top 0.61: 24.13,15.93 24.11,25.43 24.71,26.04 26.54,26.04 27.94,27.43 29.41,28.93 29.41,55.37 29.72,55.63 29.72,59.82 v29.08,60.45 | v26.29,84.58 25.15,84.58 23.24,86.49 23.24,88.39 25.2,90.27 I3.1 25.02,90.81 26.67,90.81 27.53,91.67 27.69,91.67 27.69,93.62 28.27,94.23 28.27,98.04 28.78,98.55 28.78,103.96 29.34,104.52 29.34,109.93 30.35,110.95 30.35,123.44 v30.35,126.24 33.91,126.24 | 18.39,151 v15.62,151 | v15.62,145.8 15.62,143.76 17.27,142.11 19.56,142.11 21.72,139.95 22.99,139.95 27.94,135 27.94,132.46 28.45,131.95 30.86,131.95 31.88,132.97 34.8,132.97 35.56,132.21 35.56,127.89 33.91,126.24 | 33.91,126.24 v34.42,126.24 | J6.3 23.95,4.78 24.77,5.59 v26.04,5.59 | 27.18,14.1 C45.1 | 24.13,15.88 25.78,14.22 v25.78,13.34 26.67,14.1 26.77,14 C45.1 | C45.1 26.9,14 26.8,14.1 | C13.2 149.99,132.89 149.99,131.19 148.72,129.92 J4.3 142.19,127.38 v139.32,127.38 | 130.61,125.09 136.53,125.09 v138.3,123.32
  Bottom 0.406: v22.48,13.46 24,13.46 24.38,13.84 24.38,14.35 v25.07,14.91
  Bottom 0.508: v30.35,126.24 v34.42,126.24 | 34.67,126.24 42.29,126.24 44.2,128.14 v55.32,128.14 72.14,128.14 73.41,126.87 95.38,126.87 96.65,128.14 97.79,128.14 99.06,126.87 104.01,126.87 105.54,125.09 v115.82,125.09
  Bottom 0.61: v29.08,60.45 29.08,61.34 29.44,61.67 29.44,68.83 27.53,70.76 26.92,71.37 26.92,83.69 v26.29,84.58 | v15.62,151 v15.62,145.8 | v34.42,126.24 34.67,126.24 | v26.04,5.59 26.04,5.71 28.07,7.75 28.07,12.96 27.69,13.34 v25.78,13.34 | v138.3,123.32 138.3,123.57 138.43,123.7 138.43,126.36 v139.32,127.38
B1A  (via drill 0.38)  (1 unrouted)
  Top 0.762: 65.28,31.88 63.63,31.88 61.98,33.53 61.98,122.17 62.74,122.56
  Top 0.813: 91.31,31.88 91.69,31.88 93.22,30.35 93.22,25.15 RGB53.4B | Q1.5 82.68,136.53 82.3,136.14 v82.04,136.14 | Q1.6 83.95,136.78 83.82,136.65 v83.82,136.27
  Top 1.016: 91.31,31.88 65.28,31.88 | v80.39,135.38 v80.39,134.37 v80.39,133.35 80.39,131.83 71.12,122.56 62.74,122.56
  Bottom 0.61: v80.39,135.38 v80.39,134.37
  Bottom 0.813: v82.04,136.14 82.04,136.02 | v83.82,136.27 83.82,136.53 83.69,136.53
  Bottom 1.016: RGB53.4B RGB53.4A
  pour Bottom (isolate 0.406, rank 3, no thermals): 84.61,153.03 84.58,131.57 77.98,131.44 77.75,152.91
B1B  (via drill 0.38, 0.43, 0.64)  (1 unrouted)
  Top 0.813: Q1.7 85.22,136.27 v85.72,136.27 | v85.72,136.27 86.36,136.27 86.36,136.53 | 86.36,136.53 86.36,137.92 86.49,138.05 | 86.36,136.53 86.49,136.4 v86.74,136.27 | 84.2,135.13 84.33,135.13 84.58,135.38 84.84,135.51 85.22,135.89 85.34,135.89 v85.72,136.27
  Top 1.016: v73.79,122.81 81.79,130.81 81.79,132.72 84.2,135.13 | RGB37.4 96.96,56.22 98.15,57.4 98.15,60.96 96.9,62.2 95.61,62.2 v95,63.12 | v94.13,63.98 94.13,64.01 94.89,63.25
  Bottom 0.762: 93.83,64.11 91.95,64.82 | 90.93,64.82 89.23,64.21
  Bottom 0.813: 94.21,63.93 93.7,64.14 94.11,64.03 93.83,64.11 | v95,63.12 95,62.87 | v86.74,136.27 86.74,136.14 | v85.72,136.27 85.72,136.14 | 91.95,64.82 90.93,64.82 | 89.23,64.21 88.24,63.25
  Bottom 1.016: RGB37.4B 93.22,55.5 | v73.79,122.81 70.99,122.81 69.98,121.79 69.98,63.12 70.74,62.36 87.58,62.36 88.24,63.25 | 94.87,63.27 v95,63.12 94.97,63.17 94.87,63.27 | 94.87,63.27 94.21,63.93 v94.13,63.98
  Bottom 1.27: RGB37.4A RGB37.4B
  Bottom 1.524: RGB37.4A 95.66,55.12 95.68,55.09
  pour Bottom (isolate 0.406, rank 2, no thermals): 85.47,153.29 85.45,132.46 94.11,132.46 94.11,141.1 101.73,141.1 101.73,153.16
BLU_LL
  Top 0.254: U19.1 20.66,41.19 19.3,42.55 19.3,48.26
  Top 0.305: U18.3 10.3,47.64 11.18,48.51 13.59,48.51 13.97,48.9 18.67,48.9 19.3,48.26
BLU_LR  (via drill 0.38)
  Top 0.254: U9.1 57.52,131.18 58.17,131.83 v58.17,132.46 | v76.58,140.46 76.58,141.48 75.69,142.37 75.69,143.28 U2.3
  Top 0.406: U2.3 75.55,143.26
  Bottom 0.254: v58.17,132.46 59.56,132.46 60.07,131.95 64.52,131.95 64.92,132.36 65.89,132.36 66.12,132.16 76.15,132.16 77.09,133.1 77.09,133.73 79.25,135.89 79.25,138.94 77.72,140.46 v76.58,140.46
BLU_UL  (via drill 0.38)
  Top 0.254: U13.3 7.63,105.81 5.97,104.14 5.97,103.38 6.99,102.36 18.29,102.36 18.8,101.85 18.8,97.03 19.81,95.63 v19.81,94.49 | U15.1 19.95,81.3 20.57,81.92 22.1,81.92 22.48,82.3 22.48,84.07 22.61,84.33 22.61,85.34 21.97,85.98 21.97,89.03 22.61,89.66 22.61,92.58 23.62,93.6 v23.62,93.98
  Bottom 0.254: v19.81,94.49 19.81,94.36 21.21,93.22 22.86,93.22 v23.62,93.98
BLU_UR  (via drill 0.38)
  Top 0.254: v114.55,143.13 115.06,142.62 115.06,136.27 115.7,135.64 115.7,133.35 116.46,132.59 120.22,132.59 122.99,129.82 123.9,129.82 U8.1 | v111.38,143.89 111.38,142.97 U4.3
  Bottom 0.254: v114.55,143.13 112.14,143.13 v111.38,143.89
BULA  (via drill 0.38, 0.64)  (1 unrouted)
  Top 0.813: Q7.6 v16.26,112.78 | Q7.5 16,111.51 v16.26,111.76
  Top 1.016: v26.92,107.31 26.8,106.55
  Top 1.27: v26.95,106.17 v26.92,96.14
  Bottom 0.813: v16.26,112.78 16.38,112.65 16.38,112.52 | v16.26,111.76 16.26,111.38
  Bottom 1.016: RGB17.4B RGB17.4A
  Bottom 1.27: 16.89,112.01 16.64,112.14 23.62,112.01 24.38,109.09 26.8,108.84 v26.92,107.31 v26.95,106.17 | RGB17.4B 29.59,85.6 28.32,86.87 28.3,94.84 28.19,94.94 28.19,95.76 27.81,96.14 v26.92,96.14
  pour Bottom (isolate 0.406, rank 2, no thermals): 5.08,113.03 31.88,113.03 31.88,106.81 5.21,106.81
BULB  (via drill 0.38)  (1 unrouted)
  Top 0.813: Q7.8 v16.26,115.32 | Q7.7 v16.26,114.05
  Bottom 0.813: v16.26,115.32 16.26,115.19 | v16.26,114.05 16.51,114.3
  Bottom 1.27: 16.76,114.55 25.78,114.43 26.92,116.08 RGB1.4B RGB1.4A
  pour Bottom (isolate 0.406, rank 3, no thermals): 6.22,113.92 28.96,113.79 28.96,124.97 6.22,124.97
DIR
  Top 0.305: M1.4 3.43,143.38 0.76,140.72 0.76,125.86 2.03,124.59 3.81,124.59 4.95,123.57 4.95,122.43 5.33,122.05 10.67,122.05 11.94,123.32 11.94,126.42 U11.6
G1A  (via drill 0.38)  (1 unrouted)
  Top 0.61: Q2.6 51.56,136.02 | v51.44,136.02 51.18,135.64 51.05,135.64 50.72,135.81 50.42,135.76 v50.42,136.02 Q2.5
  Top 0.711: 59.94,31.37 59.94,119.76
  Top 0.813: 59.94,119.76 58.8,120.9 | 51.56,136.02 v51.44,136.02
  Top 1.016: RGB53.6B 92.08,21.08 90.68,22.48 90.68,27.3 88.9,29.08 62.36,29.08 59.94,31.37
  Top 1.27: 58.8,120.9 54.74,120.9 51.05,124.71 51.05,135.64
  Bottom 0.813: v50.42,136.02 50.16,136.02 | v51.44,136.02 51.31,135.89
  Bottom 1.016: RGB53.6A RGB53.6B
  pour Bottom (isolate 0.406, rank 3, no thermals): 51.61,153.03 41.83,153.03 41.78,132.84 51.56,132.84
G1B  (via drill 0.38, 0.6, 0.64)  (1 unrouted)
  Top 0.406: v79.5,46.99 79.25,46.99 77.27,48.95
  Top 0.61: 53.72,136.02 54.1,135.76 | 54.1,135.76 v54.1,136.02 54.1,137.6 Q2.8 | Q2.7 52.96,136.91 53.34,136.53 54.1,135.76
  Top 0.813: 53.34,136.53 v53.09,136.02
  Top 1.016: 77.27,48.95 76.2,50.04 76.2,59.31 v75.95,59.56 | v73.91,59.56 75.82,59.56 | v79.5,46.99 v80.39,46.1
  Top 1.27: v55.24,123.19 52.7,125.6 52.7,134.75 53.72,135.76 53.72,136.02
  Bottom 0.813: v54.1,136.02 54.23,136.14
  Bottom 1.016: v55.24,123.19 55.88,122.43 66.42,122.43 67.31,121.67 67.31,60.33 68.07,59.56 v73.91,59.56 v75.95,59.56 | RGB37.6B 93.73,51.44 92.58,51.44 91.95,50.8 91.95,49.66 88.39,46.1 v80.39,46.1 | v80.39,46.1 v79.5,46.99 | v80.39,46.1 80.39,45.97
  Bottom 1.27: RGB37.6A RGB37.6B
  Bottom 1.524: RGB37.6A 95.78,51.56 95.81,51.59
  pour Bottom (isolate 0.406, rank 3, no thermals): 52.5,152.96 59.21,152.98 59.44,132.72 52.7,132.72
GRN_LL  (via drill 0.38)
  Top 0.254: v23.5,31.24 21.34,33.39 U19.2 | v22.33,23.09 22.2,23.01 19.94,20.7 17.65,18.41 13.97,18.41 12.19,16.64 12.19,15.75 11.68,15.24 10.41,15.24 9.53,14.35 8.54,14.35 U21.3
  Bottom 0.254: v23.5,31.24 24.64,30.1 24.64,24.89 22.86,23.24 22.71,23.09 v22.33,23.09
GRN_LR  (via drill 0.38)
  Top 0.254: v49.61,132.06 45.49,132.06 41.91,135.64 41.91,138.81 44.07,140.97 44.07,142.49 43.18,143.38 43.18,144.11 U1.3 43.28,144.27 | U9.2 56.9,130.68 56.64,130.94 56.64,132.06 v57.17,132.56
  Bottom 0.254: v57.17,132.56 56.87,132.56 56.64,132.33 50.16,132.33 49.89,132.06 v49.61,132.06
GRN_UL
  Top 0.254: 7.78,75.56 U16.3 | 13.72,79.25 17.02,79.25 18.54,77.72 19.56,77.72 19.68,77.85 20.45,78.4 U15.2
  Top 0.305: U16.3 8.83,75.63 9.65,76.45 11.56,76.45 12.06,76.96 12.06,77.6 13.72,79.25
GRN_UR  (via drill 0.38)
  Top 0.254: 132.44,132.46 137.92,132.46 140.21,134.75 140.21,140.84 139.19,141.86 139.19,142.79 U3.3 | U8.2 124.58,130.31 125.35,129.54 129.67,129.54 v129.87,129.64
  Top 0.305: v131.12,133.04 131.19,133.1 131.93,133.07 132.44,132.46
  Bottom 0.305: v129.87,129.64 129.74,129.72 | 129.74,129.72 129.79,129.67 | 129.74,129.72 130.3,129.67 130.68,130.07 130.68,132.77 130.89,132.97 v131.12,133.04
GULA_1  (via drill 0.38, 0.64)  (1 unrouted)
  Top 0.406: Q9.5 13.46,82.42 13.34,82.3 Q9.5A Q9.5B | 12.02,83.06 12.02,81.33 Q9.5B | Q9.5B Q9.5C
  Top 0.813: Q9.6 15.62,83.69 v16,83.44 | Q9.5 v16,82.42
  Top 1.016: RGB17.6B 32.77,81.15 28.19,76.58 27.66,76.33 24.26,76.33 | v24.26,76.71 24.26,76.33 | 24.26,76.33 v24.26,75.56
  Bottom 0.813: v16,83.44 15.88,83.44 | v16,82.42 15.88,82.3
  Bottom 1.016: RGB17.6A RGB17.6B | v24.26,76.71 24.26,76.07
  pour Bottom (isolate 0.406, rank 2, no thermals): 5.46,83.82 26.92,83.82 26.8,74.3 5.46,74.3
GULB_A  (via drill 0.38, 0.64)  (1 unrouted)
  Top 0.813: Q9.8 v16.13,86.23 | Q9.7 16,84.96 v16.13,85.09
  Top 1.016: 28.83,90.42 28.85,90.4 28.91,89.61 27.3,88.01 v24.38,88.01 v24.38,87
  Top 1.27: 28.83,90.42 28.83,93.12 29.44,93.75 29.46,96.44 29.49,97.43 29.97,97.92 29.97,103.12 30.61,103.76 v30.61,109.47
  Bottom 0.813: v16.13,86.23 16.13,85.98 | v16.13,85.09 16.26,85.09
  Bottom 1.016: v24.38,88.01 v24.38,87
  Bottom 1.27: v30.61,109.47 30.61,111.38 31.75,112.52 RGB1.6B RGB1.6A
  pour Bottom (isolate 0.406, rank 2, no thermals): 5.21,84.96 27.43,84.84 27.3,91.8 5.13,91.87
IGND  (via drill 0.38, 0.43, 0.6, 0.64, 0.81)  (1 unrouted)
  Top 0.406: U10.EP 106.1,128.85 105.54,129.41 | 31.24,135.64 SH2.2 | U7.2 93.14,131.37 v93.22,130.81
  Top 0.508: U10.EP 106.43,129.29 106.43,130.3 105.54,130.3 105.16,130.68 v105.16,131.57 | v106.43,131.57 v107.57,131.57 107.57,130.94 107.19,130.56 107.06,129.79
  Top 0.61: U17.7 16.89,69.27 17.06,69.43 | 17.06,69.43 U17.EP | U17.2 18.16,69.27 U17.EP | R41.1 14.68,63.75 15.24,63.75 16.26,64.77 16.26,67.06 17.06,67.86 17.06,69.43 | U17.EP 17.02,69.39 v17.02,67.31 | 17.78,69.85 17.78,69.47 18.41,68.83 v18.41,67.31 17.14,67.31 | U10.7 106.55,129.49 U10.EP 105.79,129.49 U10.2 | U7.7 93.14,135.64 U7.EP | U7.2 93.14,134.37 U7.EP | C15.2 86.74,131.45 87.76,130.43 | U7.EP 95.25,135 | 95.25,135 v96.77,136.53 | R21.1 87.76,130.43 | 87.76,130.43 v87,130.43 | 15.82,7.89 16.13,8.64 v16.76,6.35 | 15.82,7.89 v15.24,6.35 | U22.EP 15.37,10.29 | 15.37,10.29 v15.37,11.3 | 15.37,10.29 v16.38,11.3 | 17.53,71.25 17.53,71.5 v17.78,72.52 | U17.EP 17.53,71.25 | 17.53,71.25 v18.8,72.52 | 95.25,135 96.14,135 v96.65,134.49 | U22.2 19.63,8.18 v20.57,9.14 | U22.7 15.19,8.18 15.24,8.13 15.59,8.13 15.82,7.89 | C11.2 99.94,135.26 | 99.94,135.26 102.16,135.26 R17.1 | 99.94,135.26 99.94,136.53 v99.82,136.65 | v106.43,131.57 106.43,129.29
  Top 0.813: R41.1 14.55,63.63 13.97,63.63 12.7,63.63 C34.2 11.3,63.63 10.41,64.64 4.83,64.64 4.45,64.26 4.45,63.25 v3.43,62.36 | 9.14,2.16 v9.27,2.16 11.18,2.16 11.73,2.72 R60.1
  Top 1.27: v31.24,134.49 v32.51,134.49 v33.78,134.49 | v48.64,130.68 v47.37,130.68 45.7,130.71 45.69,130.71 C18.-
  Top 1.524: 31.24,135.64 v31.24,134.49
  Bottom 0.508: v105.16,131.57 v106.43,131.57 | v107.57,131.57 106.93,131.44
  Bottom 0.61: v17.02,67.31 v18.41,67.31 | v3.43,62.36 3.3,62.23 | v96.77,136.53 96.77,136.27 96.39,135.89 | v15.24,6.35 16.51,6.35 | v16.76,6.35 17.65,6.35 | v15.37,11.3 17.14,11.18 | 18.41,11.3 v16.38,11.3 | v17.78,72.52 17.78,72.26 | v18.8,72.52 18.54,72.14 18.41,72.01 | v96.65,134.49 96.65,133.99 | v99.82,136.65 99.69,136.65
  Bottom 0.813: v3.43,62.36 3.43,62.99 3.17,63.25
  Bottom 1.016: 3.17,4.83 3.43,6.48
  Bottom 1.27: 29.21,134.49 v31.24,134.49 | 28.83,133.22 v32.51,134.49 v31.24,134.49 | v33.78,134.49 v31.24,134.49 | v47.37,130.68 v48.64,130.68
  other vias: 22.35,134.62
  pour Bottom (isolate 0.381, rank 2): -2.67,-0.89 27.56,-0.38 27.36,12.45 3.66,12.47 4.14,65.71 24.71,65.71 24.64,73.28 4.32,73.41 4.19,115.06 15.11,126.11 108.84,125.6 108.97,133.48 102.23,133.48 101.83,140.03 95.1,140.03 95.12,131.57 40.69,131.57 40.64,135 -3.43,135.13
IR_DRV_LL  (via drill 0.64)  (5 unrouted)
  Top 0.305: R61.1 16.71,5.08 17.58,5.08
  Top 0.61: U22.1 18.75,5.16 18.04,5.06 | 18.95,5.33 C47.1
  Top 1.016: 16.71,5.08 18.04,5.06 | v20.83,2.79 20.83,4.06 19.84,5.05 C47.1
  Bottom 1.016: 36.58,30.48 34.54,30.48 33.53,31.5 33.53,33.25 IR177.A1
  Bottom 1.27: IR145.A1 33.49,46.65 34.54,45.59 36.07,45.59 36.58,45.09 36.58,30.48 36.58,15.24 | 36.58,15.24 36.58,2.03 35.81,1.14 34.29,1.14 33.53,1.91 33.53,2.8 IR240.A1 33.15,2.79 | IR209.A1 33.53,18.01 33.53,16.26 34.54,15.24 36.58,15.24
  Bottom 1.93: 33.15,2.79 v20.83,2.79
IR_DRV_LR  (via drill 0.64)  (4 unrouted)
  Top 0.61: 91.44,121.41 89.05,123.75 89.05,123.88 | 89.05,123.88 C23.1 | U7.1 91.87,129.34 89.92,127.38 89.13,127.38 R22.1 88.52,127.53 88.52,126.36 89.05,126.03 89.05,123.88 | 103.5,74.8 103.63,74.8 105.41,73.15 105.79,73.15 106.43,72.52 | 105.79,48.9 105.28,48.77 103.76,47.24 103.63,47.24 103.38,46.99
  Top 0.762: 91.44,74.8 91.44,121.41
  Top 0.813: v99.95,26.67 100.71,28.07 v100.71,30.35 | 100.71,32.77 v99.95,34.42
  Top 1.016: v100.71,30.35 100.71,32.77 | v99.95,41.78 99.95,44.45 v98.68,45.72 101.73,45.72 103,46.99 103.38,46.99 | v99.82,3.81 v99.82,1.14 | 91.44,74.8 103.5,74.8 | 106.43,49.53 105.79,48.9
  Top 1.27: 106.43,72.52 106.43,49.53
  Bottom 0.813: 99.82,15.24 99.82,15.77 99.97,15.93 v99.95,26.67
  Bottom 1.016: IR185.A1 94.49,33.25 94.49,31.62 95.76,30.35 v100.71,30.35 | D4.A1 94.23,18.01 | v99.95,34.42 v99.95,41.78 | v99.82,1.14 95.25,1.14
  Bottom 1.27: IR153.A1 94.45,47.28 96.01,45.72 v98.68,45.72 | v99.82,3.81 99.82,15.24 95.25,15.24 94.23,16.38 94.23,18.01 | 95.25,1.14 94.49,1.91 94.49,2.8 IR244.A1
IR_DRV_UL  (4 unrouted)
  Top 0.61: U17.1 20.28,66.63 20.83,66.04
  Top 1.016: 20.83,66.04 17.63,66.04 C35.1 R42.1 | IR113.A1 30.7,63.79 30.61,63.75
  Top 1.27: 30.61,63.75 28.32,66.04 20.83,66.04
  Bottom 1.016: 36.96,91.57 34.16,91.57 33.53,92.2 33.53,94.21 IR49.A1 | IR81.A1 33.02,78.59 33.02,76.96
  Bottom 1.27: IR17.A1 33.49,107.61 34.42,106.68 36.07,106.68 36.96,106.05 36.96,91.57 36.96,76.96 | 36.96,76.96 36.96,63.25 35.81,62.1 34.29,62.1 33.53,62.87 33.53,63.76 IR113.A1 | 33.02,76.96 36.96,76.96
IR_DRV_UR  (via drill 0.64)  (2 unrouted)
  Top 0.61: U10.1 103.35,130.81 101.7,130.81 R20.1 C22.1
  Top 0.813: 99.59,125.48 99.77,125.6 100.71,125.6 101.6,126.49 101.6,127.15 C22.1 | IR25.A IR25.A1 | IR117.A 93.73,65.35 v92.71,65.76
  Top 1.016: v93.73,120.52 94.61,120.52 97.79,123.7 99.59,125.48
  Bottom 0.762: 94.49,94.23 95.38,92.46
  Bottom 0.813: 93.73,109.47 94.49,109.47 | 92.7,65.79 92.58,65.93 v92.71,65.76 | 92.96,79.38 92.58,79.38 92.58,79.76
  Bottom 1.016: IR89.A1 94.38,79.01 94.36,78.99 93.34,78.99 92.96,79.38 92.2,77.72 92.2,66.17 92.7,65.79 | 92.58,79.76 92.58,79.88 92.33,80.14 92.33,90.3 93.47,91.44 94.87,91.44 95.38,91.95 95.38,92.46 | v93.73,120.52 92.33,119.13 92.33,110.87 93.73,109.47 94.36,109.47 94.38,109.49 IR25.A1 92.33,107.37 92.33,95.38 93.46,94.25 IR57.A1 94.49,94.21 94.49,94.23
  Bottom 1.27: IR89.A1 94.49,78.97
IR_LL  (via drill 0.38)
  Top 0.254: 13.25,4.96 R60.2 13.89,4.32 v14.53,4.32 | U19.5 22.84,34.56 25.02,32.38 v25.02,31.37 | v22.43,22.02 22.43,20.57 22.15,20.45 22.15,15.37 23.75,13.84 | 23.75,9.78 22.48,8.51 21.59,8.51 20.7,7.62 20.7,7.37 v20.32,6.86
  Top 0.305: 23.75,13.84 23.75,9.78
  Top 0.406: U22.8 13.25,4.96
  Bottom 0.254: v25.02,31.37 25.15,31.24 25.15,24.64 24.77,24.26 v22.43,22.02 | v14.53,4.32 14.73,4.06 18.8,4.06 19.56,4.83 19.56,6.6 19.81,6.86 v20.32,6.86
IR_LR  (via drill 0.38)
  Top 0.254: U9.5 57.29,129.18 57.28,129.16 58.8,129.16 v59.18,129.54 | 90.42,130.43 R21.2
  Top 0.406: U7.8 91.87,137.08 91.19,136.4 91.19,133.35 90.93,132.97 90.93,130.94 90.42,130.43 90.42,129.54 89.79,128.91 v87.5,128.91
  Bottom 0.254: v59.18,129.54 59.44,129.29 72.77,129.29 73.79,128.14 87.38,128.14 87.5,128.27 v87.5,128.91
IR_RET_UL  (via drill 0.38, 0.43, 0.64)
  Top 0.61: v24.49,64.16 24.49,63.86 23.62,62.99 C35.2 20.93,62.99 v19.81,64.14 | L3.1 7.16,62.99 10.16,62.99 10.79,62.36 v15.24,62.36
  Top 1.016: 23.35,79.32 R37.2 22.87,77.78 22.86,75.06 23.38,74.54 R39.2 23.37,72.73 23.75,72.26 v24.89,72.26 | 23.35,79.32 R36.2 | 23.35,79.32 23.35,81.72 R34.2
  Bottom 0.61: v15.24,62.36 15.37,62.36 15.75,61.98 16.76,61.98 17.91,63.12 17.91,63.5 18.54,64.14 v19.81,64.14
  Bottom 1.016: v24.49,64.16 24.66,64.16 25.27,64.64 25.27,69.85 24.89,70.23 v24.89,72.26
IR_RET_UL1
  Top 0.762: 27.96,15.6 29.21,14.35
  Top 0.813: C47.2 18.62,1.35 18.67,0.89 6.2,0.89 L4.1 | R54.2 25.27,24.56 R55.2 | 29.21,14.35 29.16,1.45 28.73,0.99
  Top 1.016: R55.2 25.27,21.71 R56.2 25.28,19.41 R58.2 25.35,16.43 26.19,15.6 27.96,15.6 | 28.73,0.99 27.23,0.99 19.28,1.02 C47.2
IR_RET_UL2
  Top 0.66: 92.46,81.15 92.46,90.66
  Top 0.762: 93.04,108.77 92.46,109.47 92.46,118.87 | 92.96,80.52 92.46,81.15 | 92.46,90.66 R32.2 | 92.56,91.33 92.46,92.2 92.46,106.97
  Top 0.813: 92.46,106.97 R27.2 | L2.1 100.86,142.65 98.04,139.83 98.04,132.59 96.01,130.56 96.01,127.76 94.3,126.05 | 92.46,118.87 92.46,124.33 | 92.46,124.33 R23.2 | 92.46,124.33 92.58,124.33 92.58,125.48 93.09,125.98 94.23,125.98 94.3,126.05 | C22.2 98.58,126.52 98.04,125.98 94.36,125.98 94.3,126.05
  Top 1.016: R27.2 93.04,108.77 | R38.2 93.1,77.08 93.09,77.22 92.96,77.22 92.96,80.52 | R32.2 92.56,91.33
IR_RET_UL3
  Top 0.61: 91.21,56.97 90.88,57.23 90.86,57.2 88.62,57.91 88.9,57.86
  Top 0.762: 89.66,77.98 89.66,78.11 90.42,78.87 90.42,118.87 88.14,121.16 | 89.18,64.19 91.06,64.85
  Top 0.813: 91.06,64.85 91.06,65.48 | 90.55,144.53 90.58,144.55 L1.1 90.58,140.74 89.28,138.81 89.28,135.38 88.39,134.37 85.22,134.37 84.07,133.35 84.07,129.82 83.19,128.91 83.24,124.69 83.24,124.59 83.69,124.13 85.39,124.13 85.42,124.16 C23.2 85.88,122.48 87.25,121.16 88.14,121.16 | R45.2 92.47,46.02 91.82,45.75 | 88.59,63.65 88.7,63.65 89.18,64.19
  Top 1.016: R52.2 93.84,31.87 R51.2 93.58,31.9 91.95,33.4 91.82,45.75 R47.2 92.53,50.47 91.92,51.13 91.92,56.46 91.21,56.97 | 91.06,65.48 91.06,72.75 89.66,73.91 89.66,77.98 | 88.9,57.86 87.27,59.61 87.25,62.36 88.14,63.25 88.34,63.4 88.59,63.65
IR_UL  (via drill 0.38)
  Top 0.254: v21.97,74.17 21.97,78.77 U15.5
  Top 0.305: R41.2 14.78,65.63 U17.8 14.78,66.59 v14.73,66.8
  Bottom 0.254: v21.97,74.17 23.24,74.17
  Bottom 0.305: v14.73,66.8 16.51,65.02 24,65.02 24.38,65.41 24.38,69.34 24,69.72 24,73.41 23.24,74.17
IR_UR  (via drill 0.38)
  Top 0.254: U8.5 121.94,131.81 120.65,133.1 118.49,133.1 v118.11,133.48 | v110.62,130.68 109.25,130.68 U10.8
  Top 0.406: R17.2 103.43,133.55 v104.39,134.49